# EAGLE design DATALOGGER_CA_ADC_V1 (EAGLE 9.5.1)

## Sheet 1 of 11
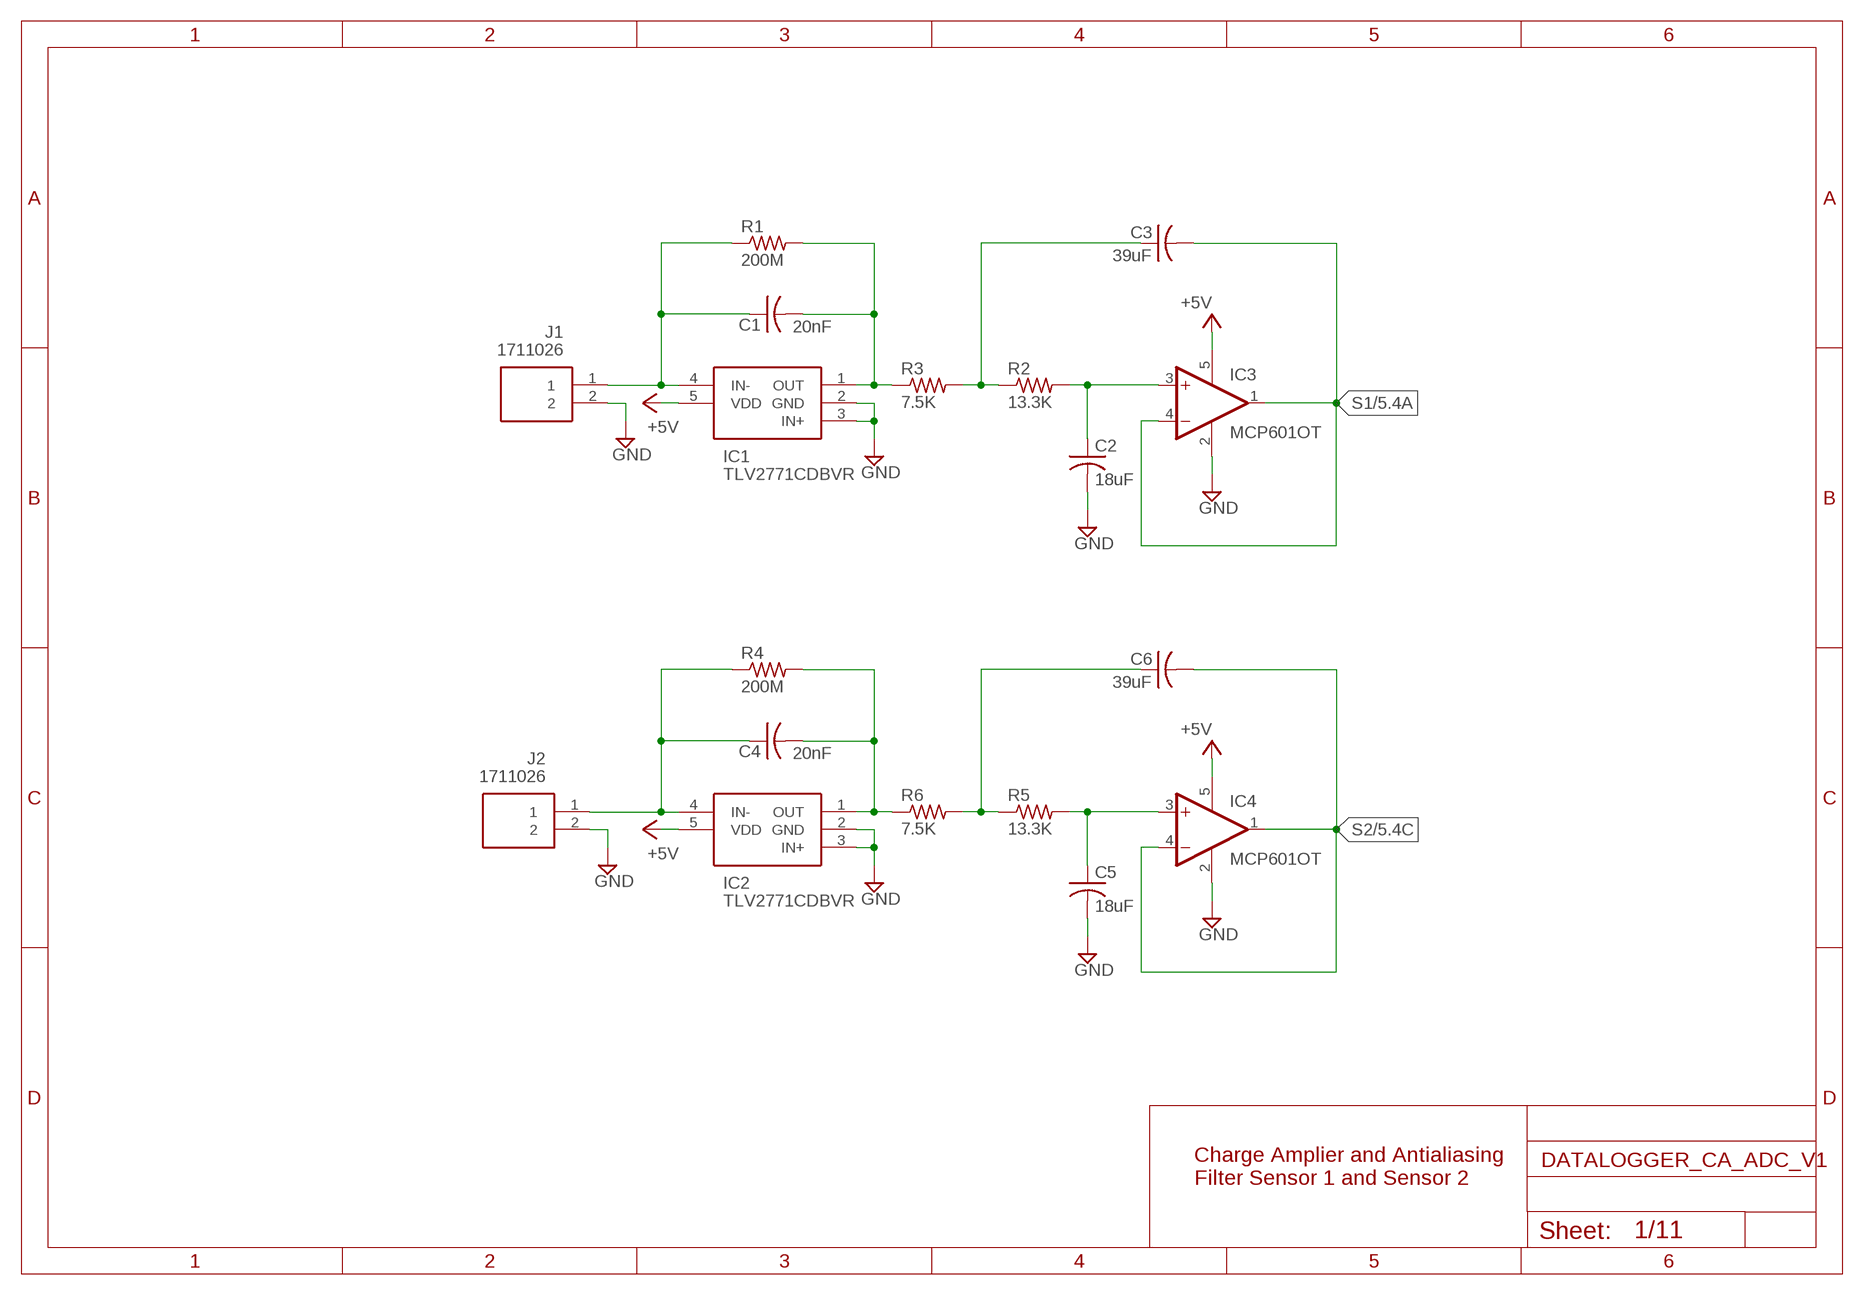
[diagram p0: schematic, sheet 1]

### Parts
C1  20nF  C-USC0805  [C0805]
C2  18uF  C-USC0805  [C0805]
C3  39uF  C-USC0805  [C0805]
C4  20nF  C-USC0805  [C0805]
C5  18uF  C-USC0805  [C0805]
C6  39uF  C-USC0805  [C0805]
IC1  TLV2771CDBVR  [SOT95P280X145-5N]
IC2  TLV2771CDBVR  [SOT95P280X145-5N]
IC3  MCP601OT  [SOT23-5]
IC4  MCP601OT  [SOT23-5]
J1  1711026  [SHDR2W110P0X500_1X2_1000X1120X]
J2  1711026  [SHDR2W110P0X500_1X2_1000X1120X]
R1  200M  R-US_R0805  [R0805]
R2  13.3K  R-US_R0805  [R0805]
R3  7.5K  R-US_R0805  [R0805]
R4  200M  R-US_R0805  [R0805]
R5  13.3K  R-US_R0805  [R0805]
R6  7.5K  R-US_R0805  [R0805]

### Nets
+5V: IC1.5(VDD) IC2.5(VDD) IC3.5(V+) IC4.5(V+) ; also sheet 2,3,4,9,10,11
GND: C2.2 C5.2 IC1.2(GND) IC1.3(IN+) IC2.2(GND) IC2.3(IN+) IC3.2(V-) IC4.2(V-) J1.2 J2.2 ; also sheet 2,3,4,5,6,7,8,9,10,11
N$1: C1.1 IC1.4(IN-) J1.1 R1.1
N$2: C1.2 IC1.1(OUT) R1.2 R3.1
N$3: C2.1 IC3.3(+IN) R2.2
N$4: C3.1 R2.1 R3.2
N$5: C4.1 IC2.4(IN-) J2.1 R4.1
N$6: C4.2 IC2.1(OUT) R4.2 R6.1
N$7: C5.1 IC4.3(+IN) R5.2
N$8: C6.1 R5.1 R6.2
S1: C3.2 IC3.1(OUT) IC3.4(-IN) ; also sheet 5
S2: C6.2 IC4.1(OUT) IC4.4(-IN) ; also sheet 5

### Notes on the sheet
- Charge Amplier and Antialiasing 
  Filter Sensor 1 and Sensor 2

## Sheet 2 of 11
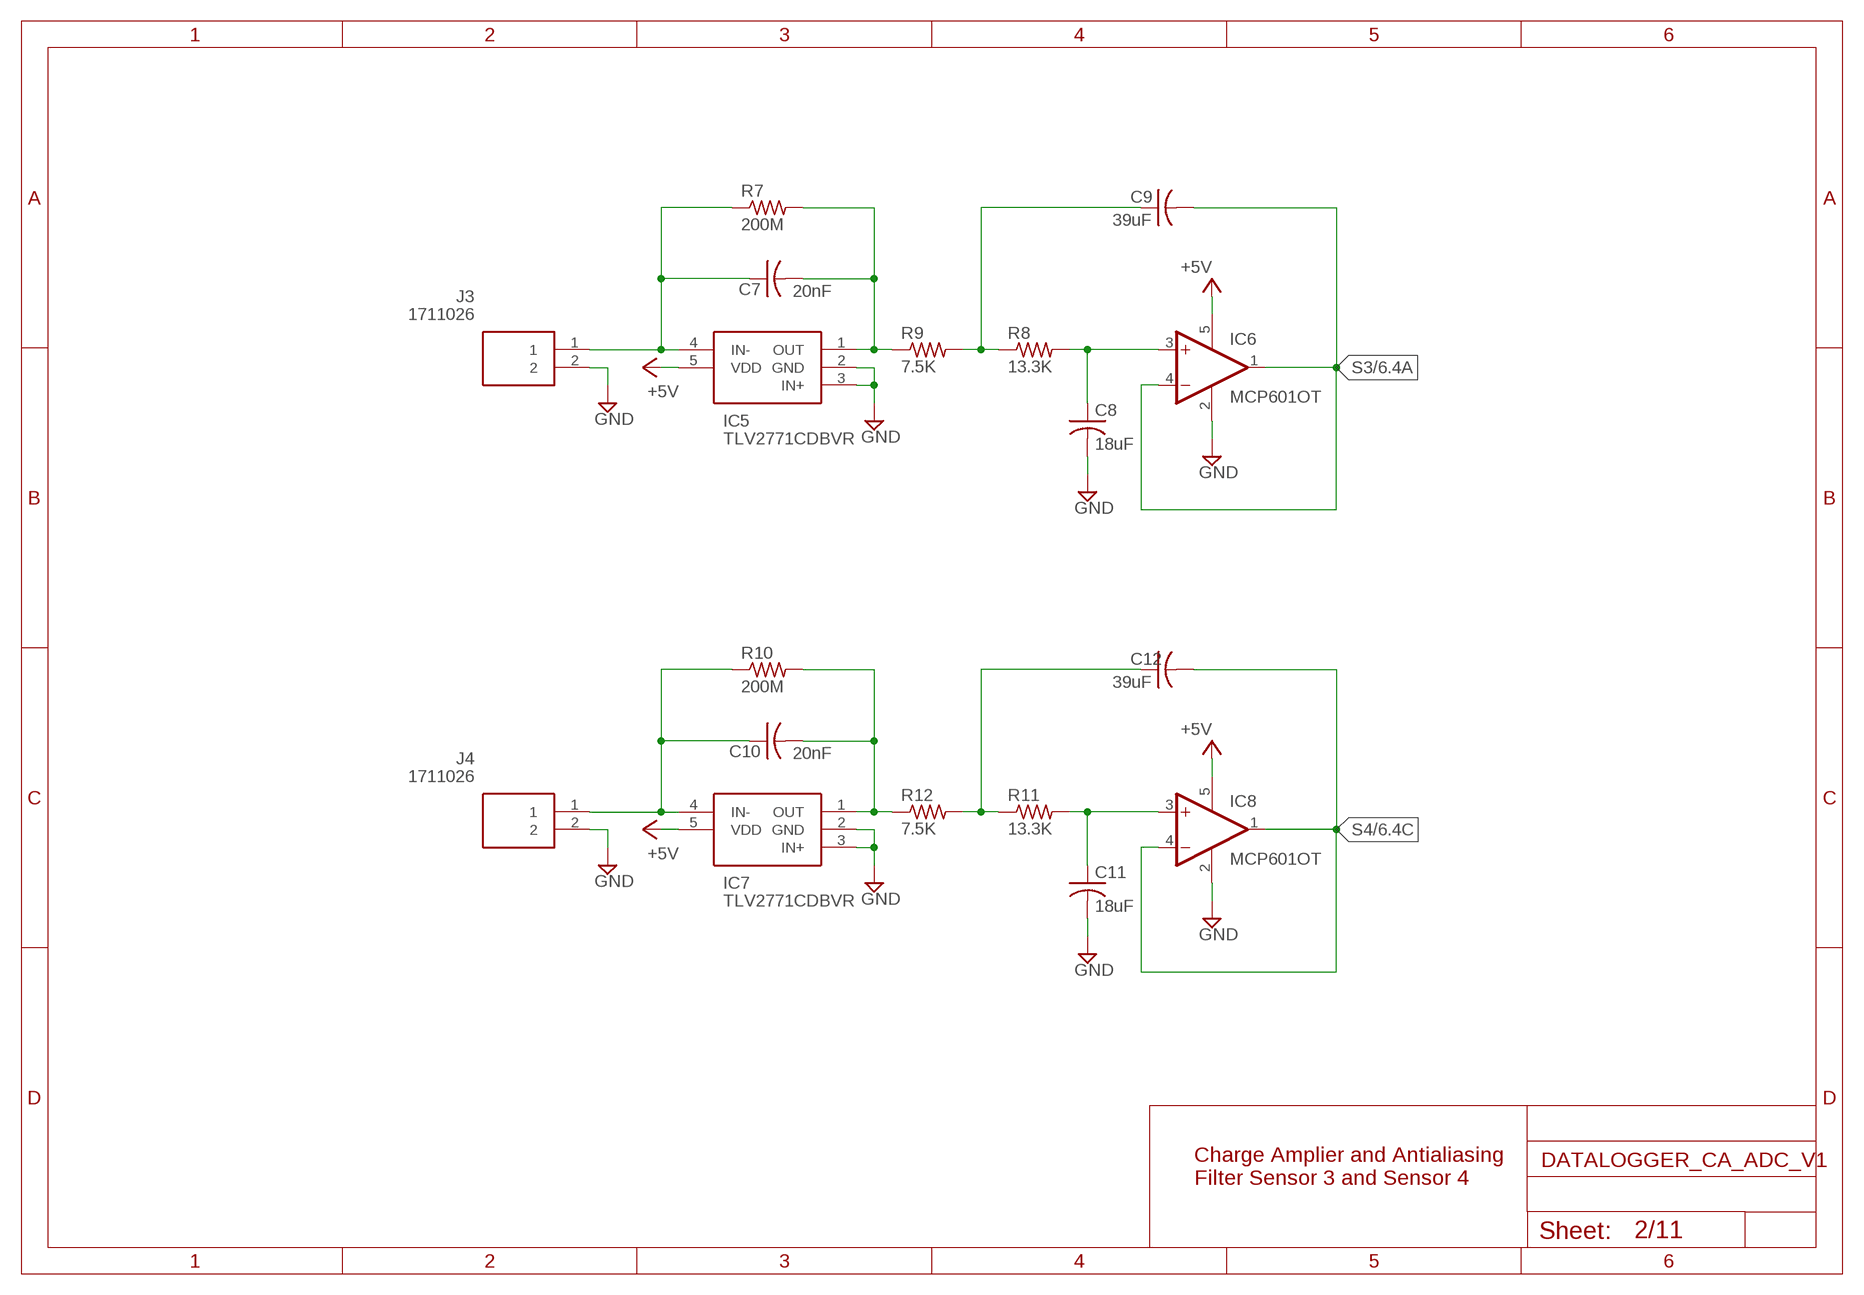
[diagram p1: schematic, sheet 2]

### Parts
C7  20nF  C-USC0805  [C0805]
C8  18uF  C-USC0805  [C0805]
C9  39uF  C-USC0805  [C0805]
C10  20nF  C-USC0805  [C0805]
C11  18uF  C-USC0805  [C0805]
C12  39uF  C-USC0805  [C0805]
IC5  TLV2771CDBVR  [SOT95P280X145-5N]
IC6  MCP601OT  [SOT23-5]
IC7  TLV2771CDBVR  [SOT95P280X145-5N]
IC8  MCP601OT  [SOT23-5]
J3  1711026  [SHDR2W110P0X500_1X2_1000X1120X]
J4  1711026  [SHDR2W110P0X500_1X2_1000X1120X]
R7  200M  R-US_R0805  [R0805]
R8  13.3K  R-US_R0805  [R0805]
R9  7.5K  R-US_R0805  [R0805]
R10  200M  R-US_R0805  [R0805]
R11  13.3K  R-US_R0805  [R0805]
R12  7.5K  R-US_R0805  [R0805]

### Nets
+5V: IC5.5(VDD) IC6.5(V+) IC7.5(VDD) IC8.5(V+) ; also sheet 1,3,4,9,10,11
GND: C8.2 C11.2 IC5.2(GND) IC5.3(IN+) IC6.2(V-) IC7.2(GND) IC7.3(IN+) IC8.2(V-) J3.2 J4.2 ; also sheet 1,3,4,5,6,7,8,9,10,11
N$9: C7.1 IC5.4(IN-) J3.1 R7.1
N$10: C7.2 IC5.1(OUT) R7.2 R9.1
N$11: C8.1 IC6.3(+IN) R8.2
N$12: C9.1 R8.1 R9.2
N$13: C10.1 IC7.4(IN-) J4.1 R10.1
N$14: C10.2 IC7.1(OUT) R10.2 R12.1
N$15: C11.1 IC8.3(+IN) R11.2
N$16: C12.1 R11.1 R12.2
S3: C9.2 IC6.1(OUT) IC6.4(-IN) ; also sheet 6
S4: C12.2 IC8.1(OUT) IC8.4(-IN) ; also sheet 6

### Notes on the sheet
- Charge Amplier and Antialiasing 
  Filter Sensor 3 and Sensor 4

## Sheet 3 of 11
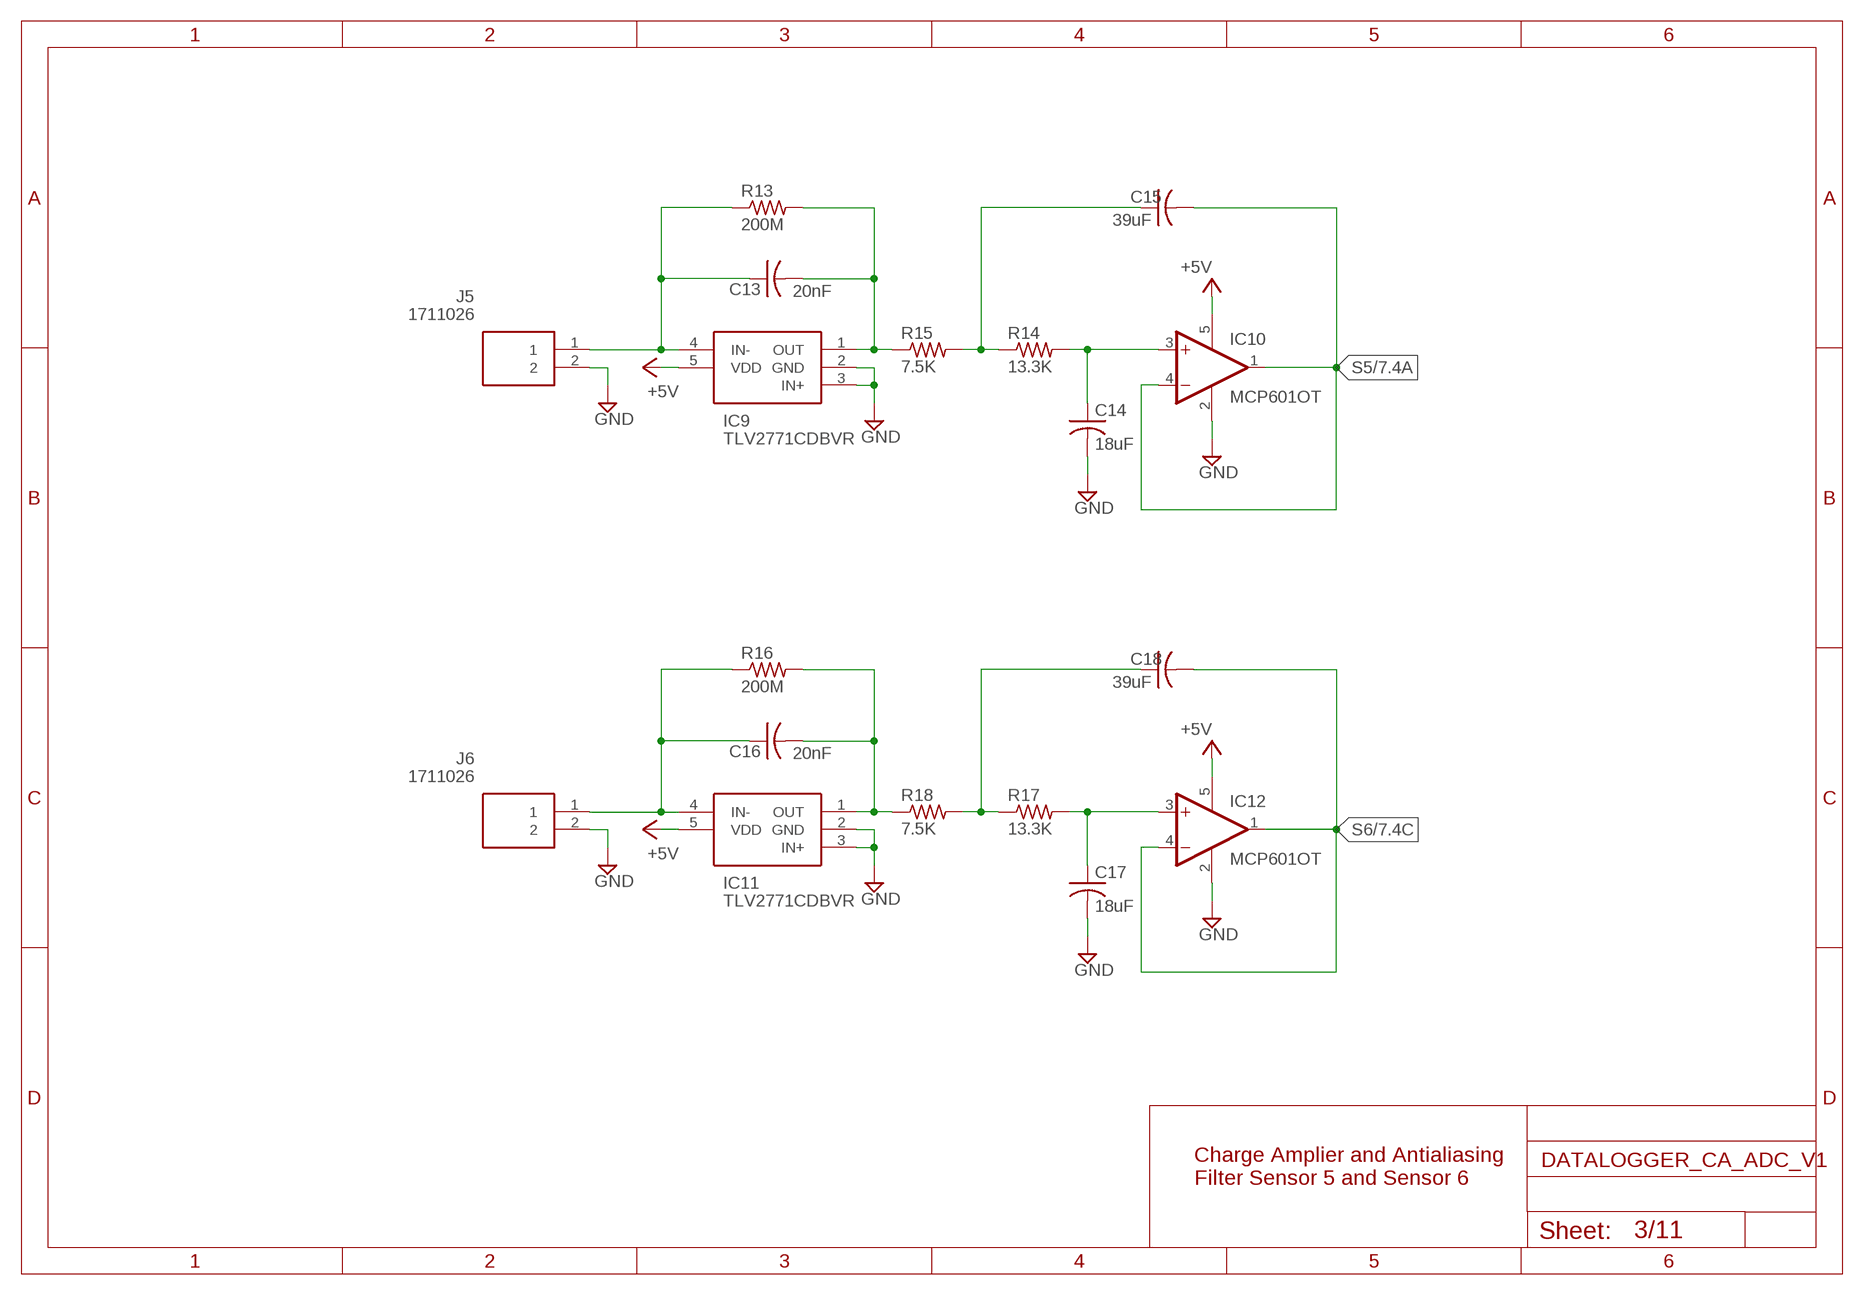
[diagram p2: schematic, sheet 3]

### Parts
C13  20nF  C-USC0805  [C0805]
C14  18uF  C-USC0805  [C0805]
C15  39uF  C-USC0805  [C0805]
C16  20nF  C-USC0805  [C0805]
C17  18uF  C-USC0805  [C0805]
C18  39uF  C-USC0805  [C0805]
IC9  TLV2771CDBVR  [SOT95P280X145-5N]
IC10  MCP601OT  [SOT23-5]
IC11  TLV2771CDBVR  [SOT95P280X145-5N]
IC12  MCP601OT  [SOT23-5]
J5  1711026  [SHDR2W110P0X500_1X2_1000X1120X]
J6  1711026  [SHDR2W110P0X500_1X2_1000X1120X]
R13  200M  R-US_R0805  [R0805]
R14  13.3K  R-US_R0805  [R0805]
R15  7.5K  R-US_R0805  [R0805]
R16  200M  R-US_R0805  [R0805]
R17  13.3K  R-US_R0805  [R0805]
R18  7.5K  R-US_R0805  [R0805]

### Nets
+5V: IC9.5(VDD) IC10.5(V+) IC11.5(VDD) IC12.5(V+) ; also sheet 1,2,4,9,10,11
GND: C14.2 C17.2 IC9.2(GND) IC9.3(IN+) IC10.2(V-) IC11.2(GND) IC11.3(IN+) IC12.2(V-) J5.2 J6.2 ; also sheet 1,2,4,5,6,7,8,9,10,11
N$17: C13.1 IC9.4(IN-) J5.1 R13.1
N$18: C13.2 IC9.1(OUT) R13.2 R15.1
N$19: C14.1 IC10.3(+IN) R14.2
N$20: C15.1 R14.1 R15.2
N$21: C16.1 IC11.4(IN-) J6.1 R16.1
N$22: C16.2 IC11.1(OUT) R16.2 R18.1
N$23: C17.1 IC12.3(+IN) R17.2
N$24: C18.1 R17.1 R18.2
S5: C15.2 IC10.1(OUT) IC10.4(-IN) ; also sheet 7
S6: C18.2 IC12.1(OUT) IC12.4(-IN) ; also sheet 7

### Notes on the sheet
- Charge Amplier and Antialiasing 
  Filter Sensor 5 and Sensor 6

## Sheet 4 of 11
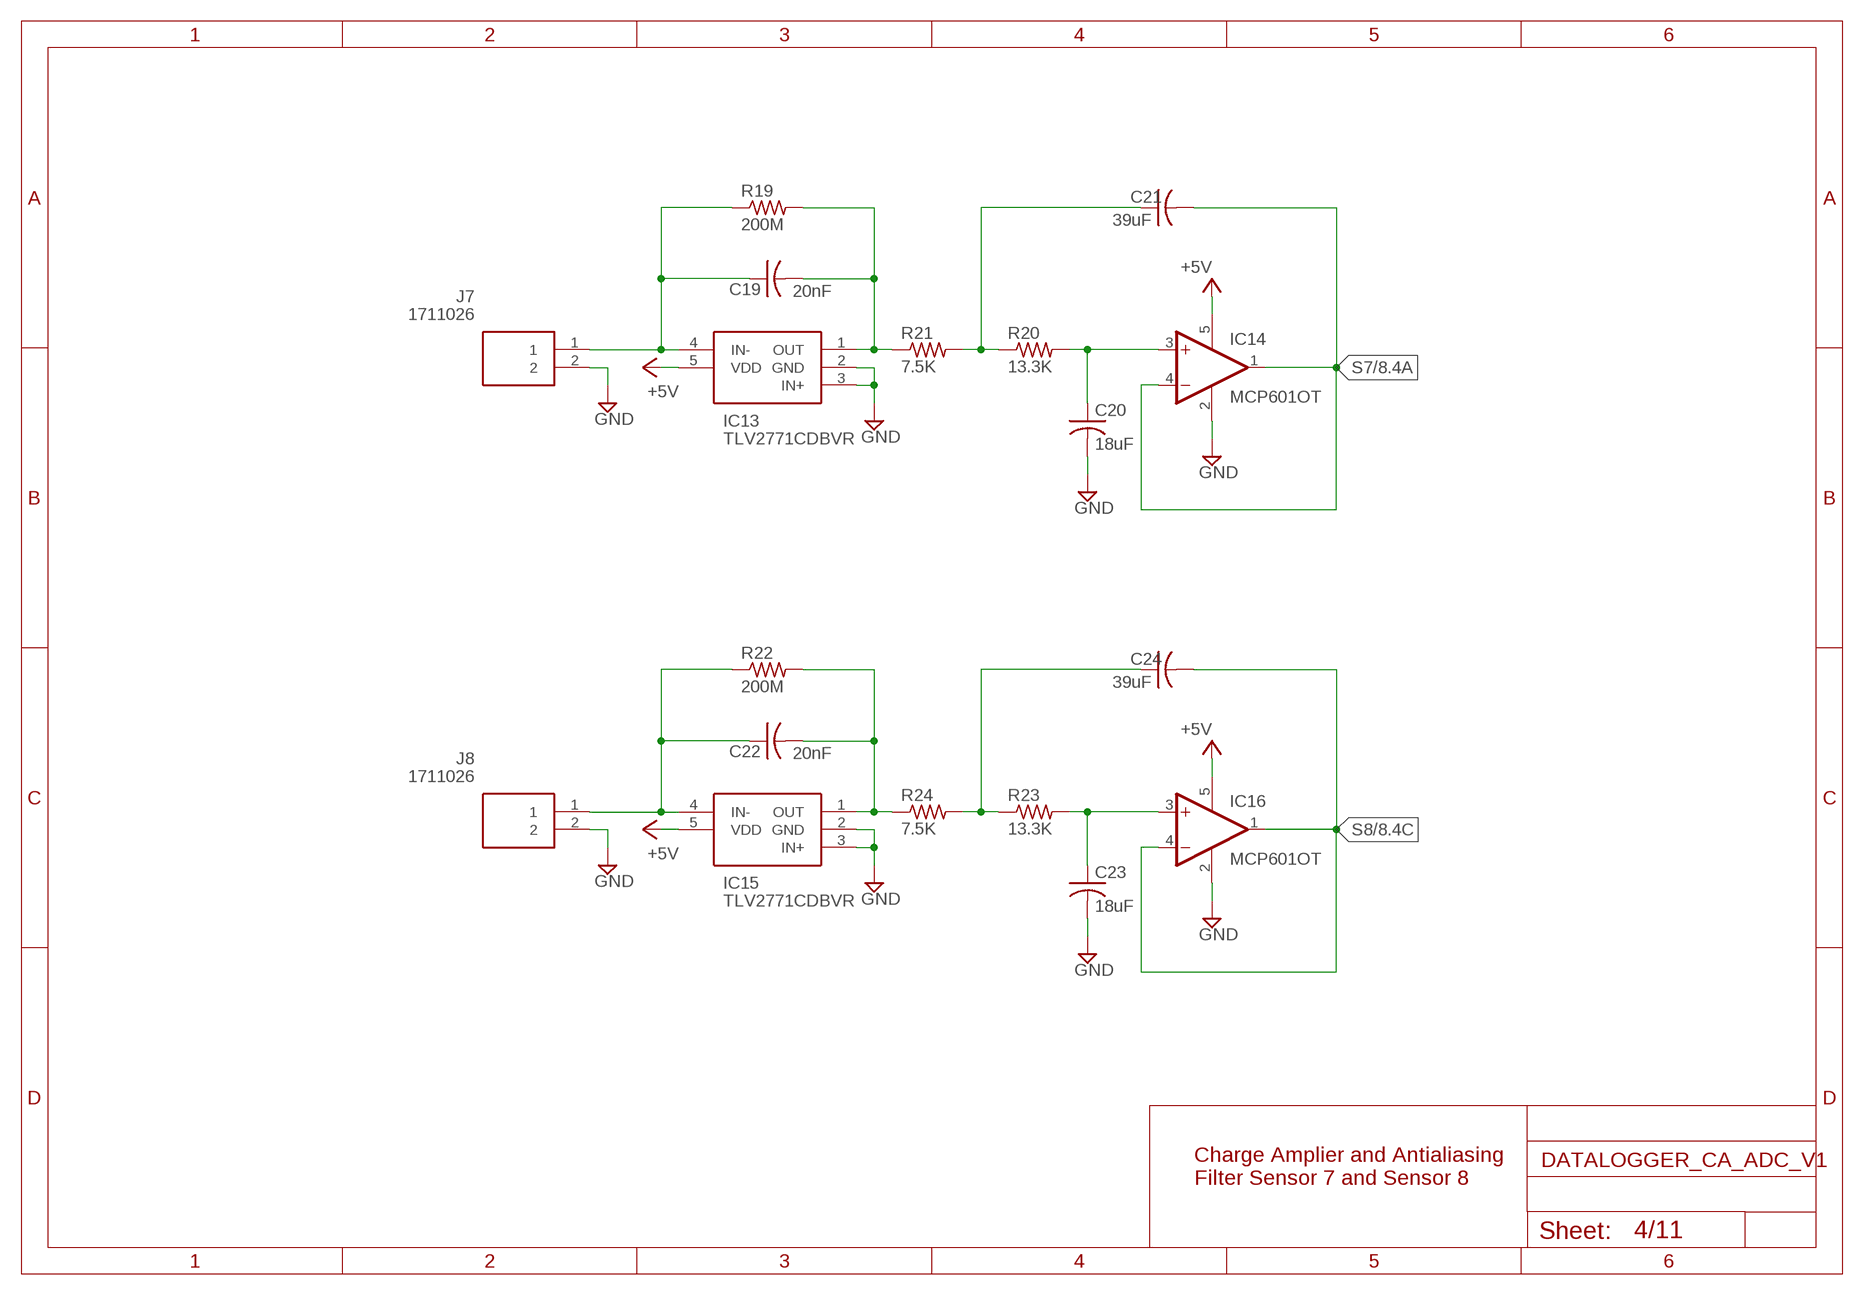
[diagram p3: schematic, sheet 4]

### Parts
C19  20nF  C-USC0805  [C0805]
C20  18uF  C-USC0805  [C0805]
C21  39uF  C-USC0805  [C0805]
C22  20nF  C-USC0805  [C0805]
C23  18uF  C-USC0805  [C0805]
C24  39uF  C-USC0805  [C0805]
IC13  TLV2771CDBVR  [SOT95P280X145-5N]
IC14  MCP601OT  [SOT23-5]
IC15  TLV2771CDBVR  [SOT95P280X145-5N]
IC16  MCP601OT  [SOT23-5]
J7  1711026  [SHDR2W110P0X500_1X2_1000X1120X]
J8  1711026  [SHDR2W110P0X500_1X2_1000X1120X]
R19  200M  R-US_R0805  [R0805]
R20  13.3K  R-US_R0805  [R0805]
R21  7.5K  R-US_R0805  [R0805]
R22  200M  R-US_R0805  [R0805]
R23  13.3K  R-US_R0805  [R0805]
R24  7.5K  R-US_R0805  [R0805]

### Nets
+5V: IC13.5(VDD) IC14.5(V+) IC15.5(VDD) IC16.5(V+) ; also sheet 1,2,3,9,10,11
GND: C20.2 C23.2 IC13.2(GND) IC13.3(IN+) IC14.2(V-) IC15.2(GND) IC15.3(IN+) IC16.2(V-) J7.2 J8.2 ; also sheet 1,2,3,5,6,7,8,9,10,11
N$25: C19.1 IC13.4(IN-) J7.1 R19.1
N$26: C19.2 IC13.1(OUT) R19.2 R21.1
N$27: C20.1 IC14.3(+IN) R20.2
N$28: C21.1 R20.1 R21.2
N$29: C22.1 IC15.4(IN-) J8.1 R22.1
N$30: C22.2 IC15.1(OUT) R22.2 R24.1
N$31: C23.1 IC16.3(+IN) R23.2
N$32: C24.1 R23.1 R24.2
S7: C21.2 IC14.1(OUT) IC14.4(-IN) ; also sheet 8
S8: C24.2 IC16.1(OUT) IC16.4(-IN) ; also sheet 8

### Notes on the sheet
- Charge Amplier and Antialiasing 
  Filter Sensor 7 and Sensor 8

## Sheet 5 of 11
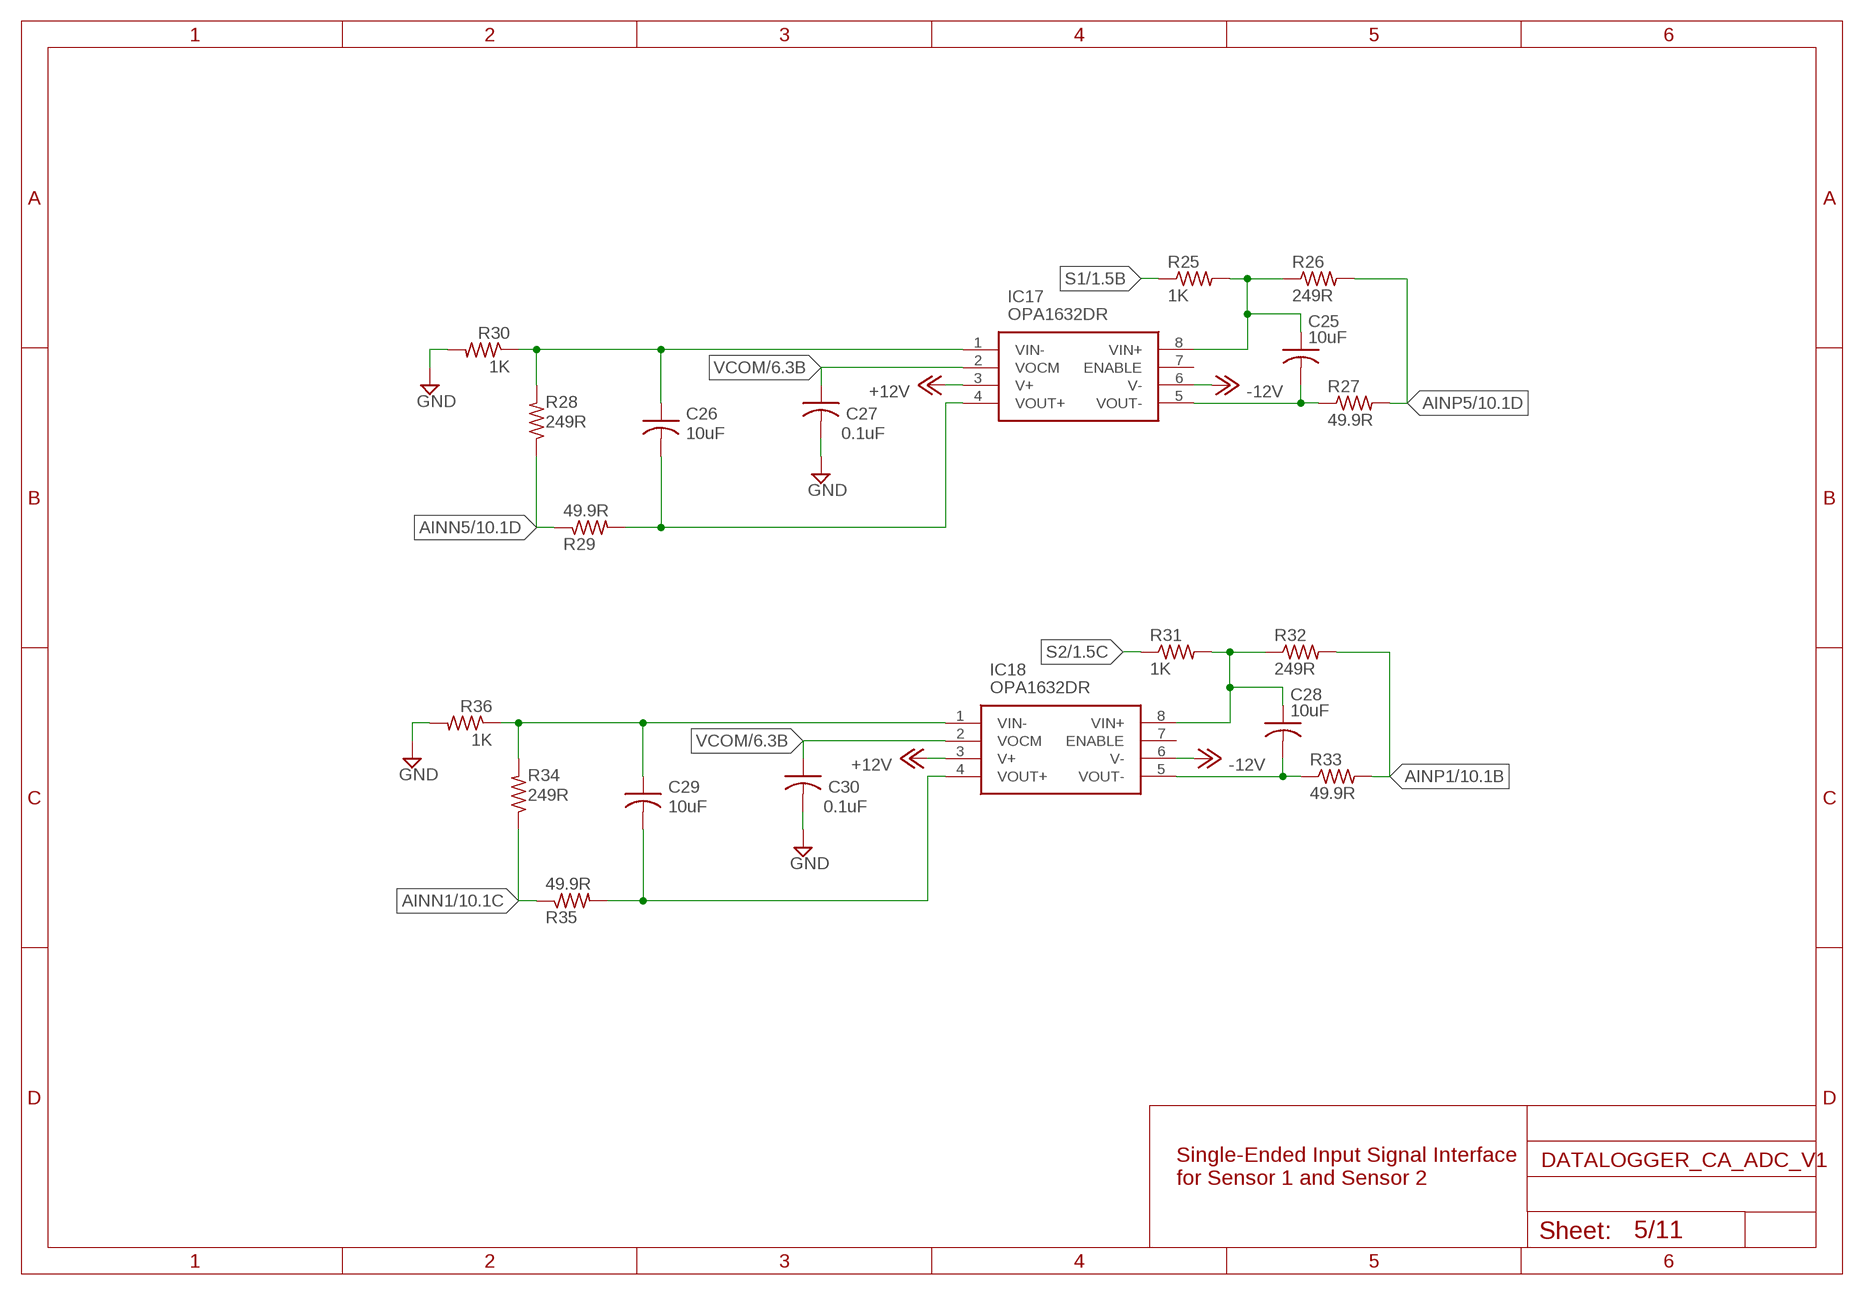
[diagram p4: schematic, sheet 5]

### Parts
C25  10uF  C-USC0805  [C0805]
C26  10uF  C-USC0805  [C0805]
C27  0.1uF  C-USC0805  [C0805]
C28  10uF  C-USC0805  [C0805]
C29  10uF  C-USC0805  [C0805]
C30  0.1uF  C-USC0805  [C0805]
IC17  OPA1632DR  [SOIC127P600X175-8N]
IC18  OPA1632DR  [SOIC127P600X175-8N]
R25  1K  R-US_R0805  [R0805]
R26  249R  R-US_R0805  [R0805]
R27  49.9R  R-US_R0805  [R0805]
R28  249R  R-US_R0805  [R0805]
R29  49.9R  R-US_R0805  [R0805]
R30  1K  R-US_R0805  [R0805]
R31  1K  R-US_R0805  [R0805]
R32  249R  R-US_R0805  [R0805]
R33  49.9R  R-US_R0805  [R0805]
R34  249R  R-US_R0805  [R0805]
R35  49.9R  R-US_R0805  [R0805]
R36  1K  R-US_R0805  [R0805]

### Nets
+12V: IC17.3(V+) IC18.3(V+) ; also sheet 6,7,8,9
-12V: IC17.6(V-) IC18.6(V-) ; also sheet 6,7,8,9
AINN1: R34.1 R35.1 ; also sheet 10,11
AINN5: R28.1 R29.1 ; also sheet 10,11
AINP1: R32.2 R33.2 ; also sheet 10,11
AINP5: R26.2 R27.2 ; also sheet 10,11
GND: C27.2 C30.2 R30.2 R36.2 ; also sheet 1,2,3,4,6,7,8,9,10,11
N$33: C25.1 IC17.8(VIN+) R25.2 R26.1
N$34: C25.2 IC17.5(VOUT-) R27.1
N$35: C26.1 IC17.1(VIN-) R28.2 R30.1
N$36: C28.1 IC18.8(VIN+) R31.2 R32.1
N$37: C26.2 IC17.4(VOUT+) R29.2
N$38: C28.2 IC18.5(VOUT-) R33.1
N$39: C29.1 IC18.1(VIN-) R34.2 R36.1
N$40: C29.2 IC18.4(VOUT+) R35.2
S1: R25.1 ; also sheet 1
S2: R31.1 ; also sheet 1
VCOM: C27.1 C30.1 IC17.2(VOCM) IC18.2(VOCM) ; also sheet 6,7,8,10
Unconnected: IC17.7(ENABLE) IC18.7(ENABLE)

### Notes on the sheet
- Single-Ended Input Signal Interface 
  for Sensor 1 and Sensor 2

## Sheet 6 of 11
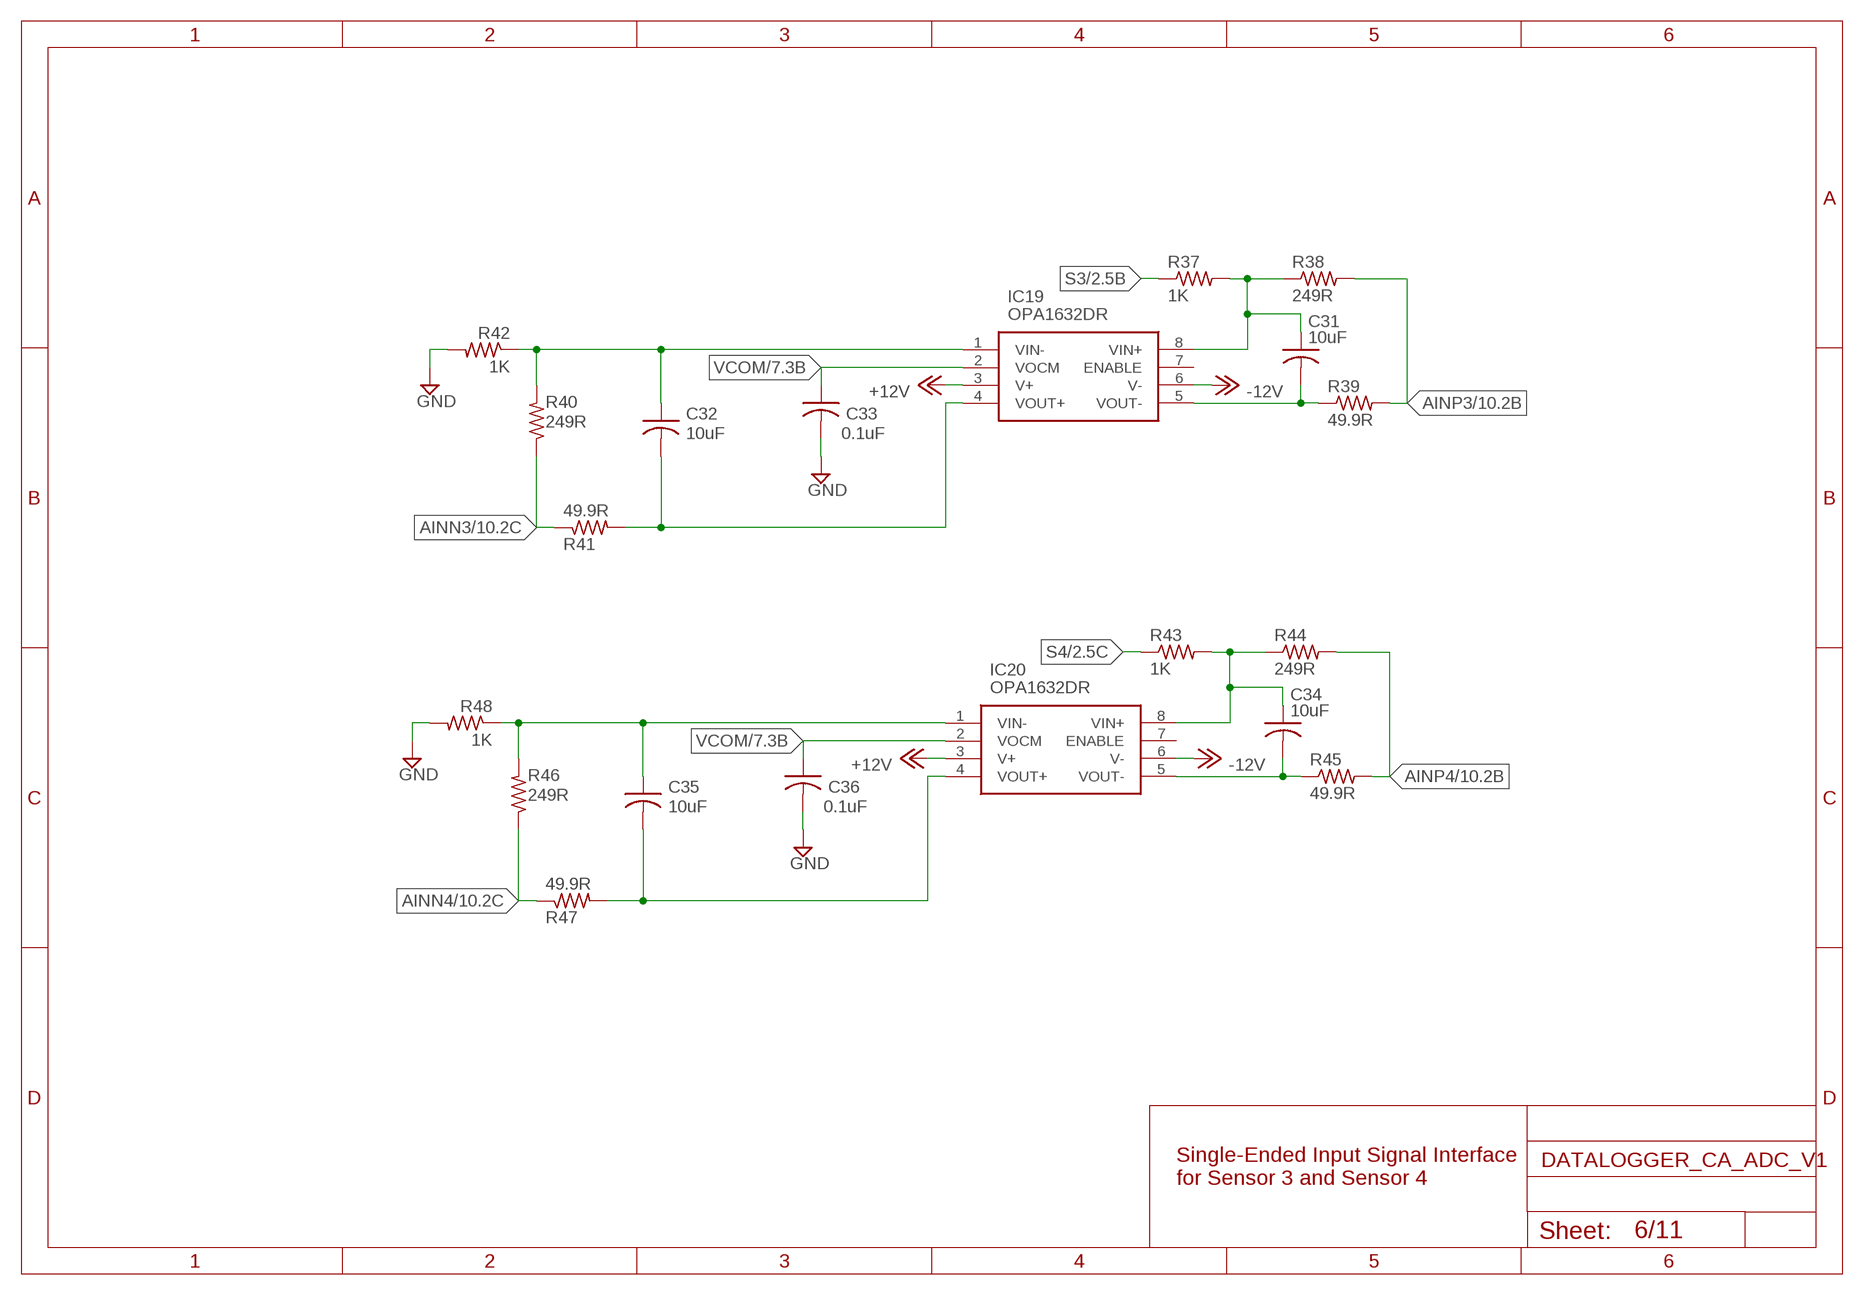
[diagram p5: schematic, sheet 6]

### Parts
C31  10uF  C-USC0805  [C0805]
C32  10uF  C-USC0805  [C0805]
C33  0.1uF  C-USC0805  [C0805]
C34  10uF  C-USC0805  [C0805]
C35  10uF  C-USC0805  [C0805]
C36  0.1uF  C-USC0805  [C0805]
IC19  OPA1632DR  [SOIC127P600X175-8N]
IC20  OPA1632DR  [SOIC127P600X175-8N]
R37  1K  R-US_R0805  [R0805]
R38  249R  R-US_R0805  [R0805]
R39  49.9R  R-US_R0805  [R0805]
R40  249R  R-US_R0805  [R0805]
R41  49.9R  R-US_R0805  [R0805]
R42  1K  R-US_R0805  [R0805]
R43  1K  R-US_R0805  [R0805]
R44  249R  R-US_R0805  [R0805]
R45  49.9R  R-US_R0805  [R0805]
R46  249R  R-US_R0805  [R0805]
R47  49.9R  R-US_R0805  [R0805]
R48  1K  R-US_R0805  [R0805]

### Nets
+12V: IC19.3(V+) IC20.3(V+) ; also sheet 5,7,8,9
-12V: IC19.6(V-) IC20.6(V-) ; also sheet 5,7,8,9
AINN3: R40.1 R41.1 ; also sheet 10,11
AINN4: R46.1 R47.1 ; also sheet 10,11
AINP3: R38.2 R39.2 ; also sheet 10,11
AINP4: R44.2 R45.2 ; also sheet 10,11
GND: C33.2 C36.2 R42.2 R48.2 ; also sheet 1,2,3,4,5,7,8,9,10,11
N$41: C31.1 IC19.8(VIN+) R37.2 R38.1
N$42: C31.2 IC19.5(VOUT-) R39.1
N$43: C32.1 IC19.1(VIN-) R40.2 R42.1
N$44: C32.2 IC19.4(VOUT+) R41.2
N$45: C34.1 IC20.8(VIN+) R43.2 R44.1
N$46: C34.2 IC20.5(VOUT-) R45.1
N$47: C35.1 IC20.1(VIN-) R46.2 R48.1
N$48: C35.2 IC20.4(VOUT+) R47.2
S3: R37.1 ; also sheet 2
S4: R43.1 ; also sheet 2
VCOM: C33.1 C36.1 IC19.2(VOCM) IC20.2(VOCM) ; also sheet 5,7,8,10
Unconnected: IC19.7(ENABLE) IC20.7(ENABLE)

### Notes on the sheet
- Single-Ended Input Signal Interface 
  for Sensor 3 and Sensor 4

## Sheet 7 of 11
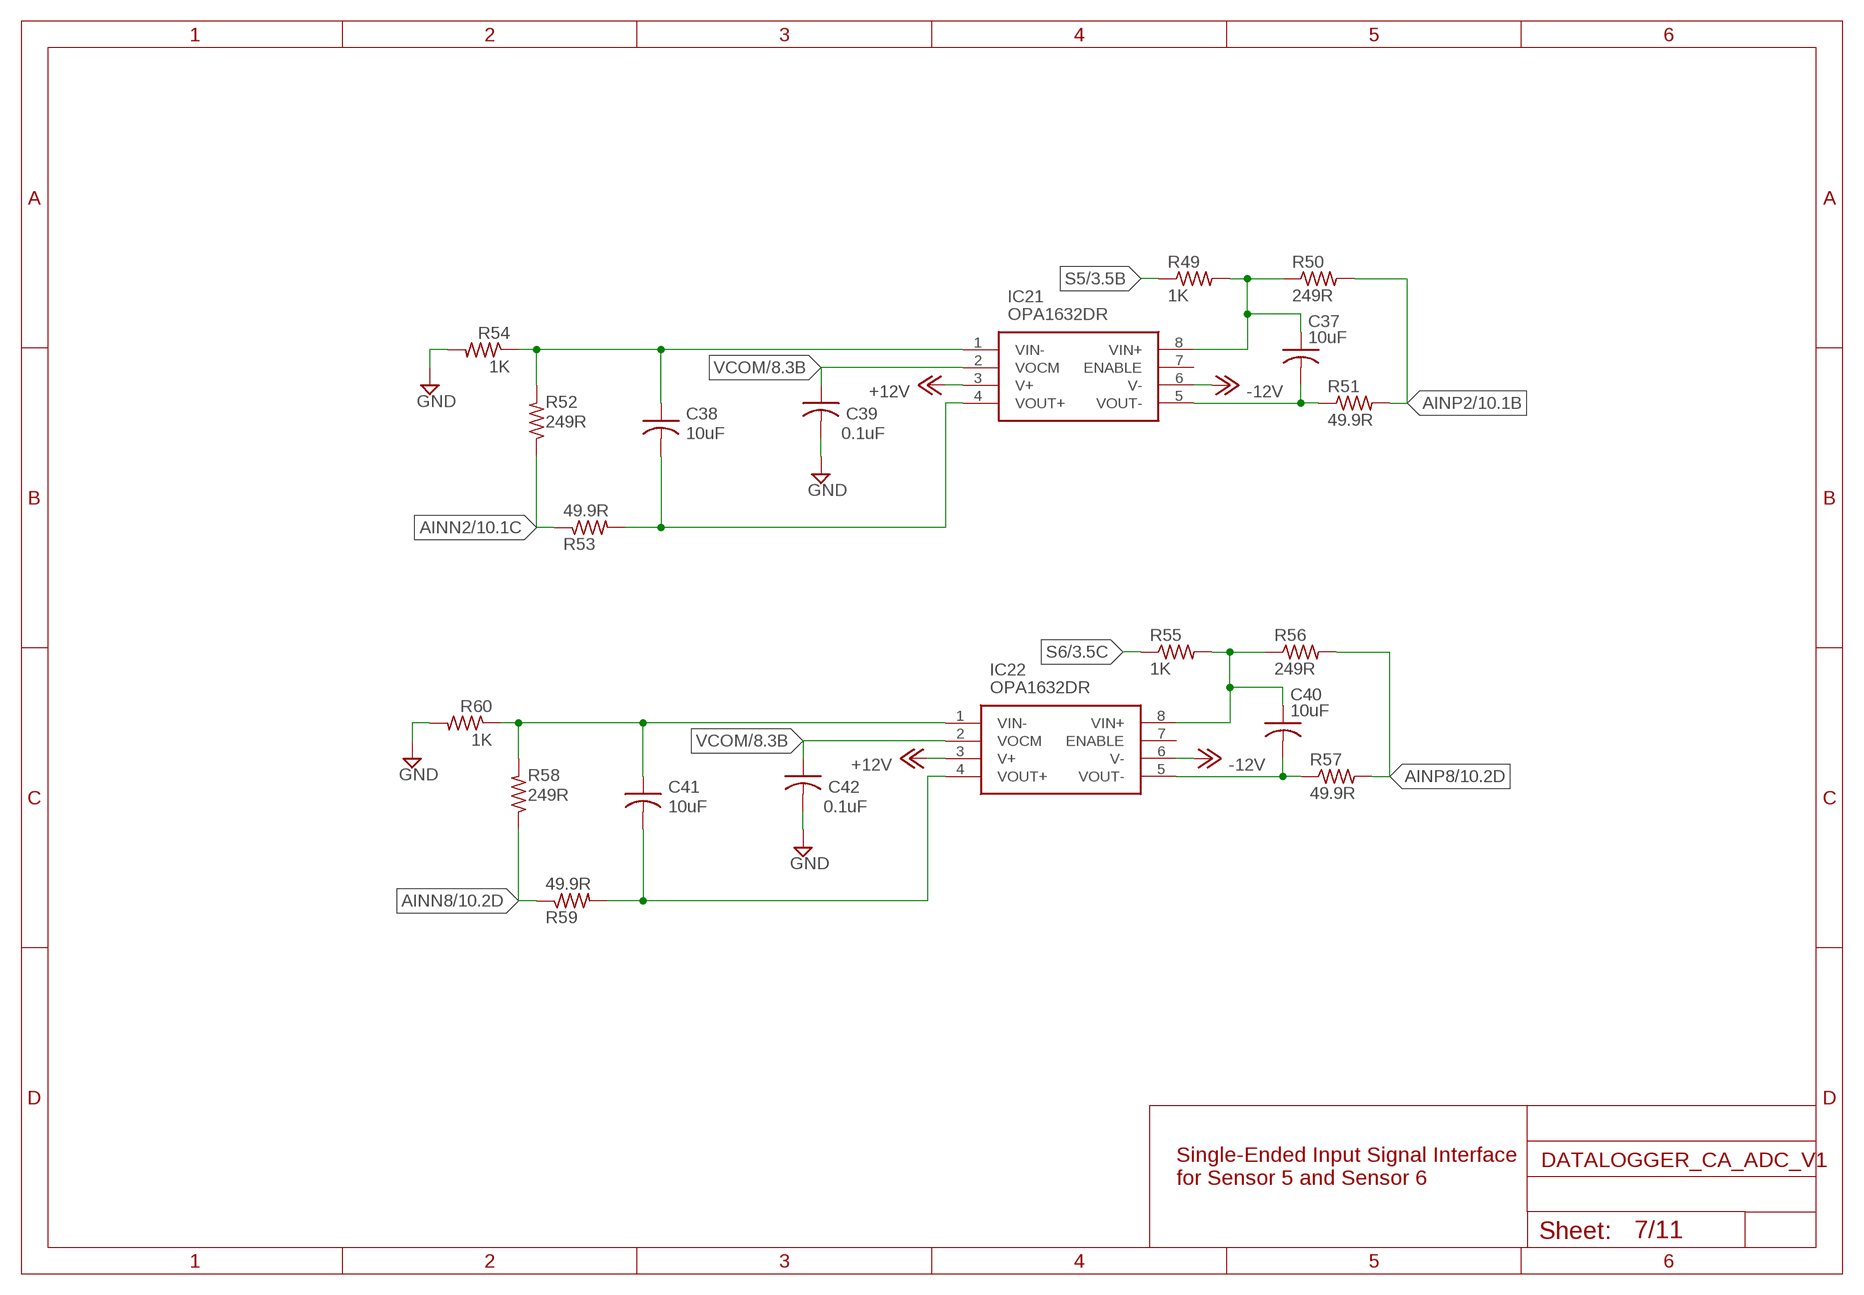
[diagram p6: schematic, sheet 7]

### Parts
C37  10uF  C-USC0805  [C0805]
C38  10uF  C-USC0805  [C0805]
C39  0.1uF  C-USC0805  [C0805]
C40  10uF  C-USC0805  [C0805]
C41  10uF  C-USC0805  [C0805]
C42  0.1uF  C-USC0805  [C0805]
IC21  OPA1632DR  [SOIC127P600X175-8N]
IC22  OPA1632DR  [SOIC127P600X175-8N]
R49  1K  R-US_R0805  [R0805]
R50  249R  R-US_R0805  [R0805]
R51  49.9R  R-US_R0805  [R0805]
R52  249R  R-US_R0805  [R0805]
R53  49.9R  R-US_R0805  [R0805]
R54  1K  R-US_R0805  [R0805]
R55  1K  R-US_R0805  [R0805]
R56  249R  R-US_R0805  [R0805]
R57  49.9R  R-US_R0805  [R0805]
R58  249R  R-US_R0805  [R0805]
R59  49.9R  R-US_R0805  [R0805]
R60  1K  R-US_R0805  [R0805]

### Nets
+12V: IC21.3(V+) IC22.3(V+) ; also sheet 5,6,8,9
-12V: IC21.6(V-) IC22.6(V-) ; also sheet 5,6,8,9
AINN2: R52.1 R53.1 ; also sheet 10,11
AINN8: R58.1 R59.1 ; also sheet 10,11
AINP2: R50.2 R51.2 ; also sheet 10,11
AINP8: R56.2 R57.2 ; also sheet 10,11
GND: C39.2 C42.2 R54.2 R60.2 ; also sheet 1,2,3,4,5,6,8,9,10,11
N$49: C37.1 IC21.8(VIN+) R49.2 R50.1
N$50: C37.2 IC21.5(VOUT-) R51.1
N$51: C38.1 IC21.1(VIN-) R52.2 R54.1
N$52: C38.2 IC21.4(VOUT+) R53.2
N$53: C40.1 IC22.8(VIN+) R55.2 R56.1
N$54: C40.2 IC22.5(VOUT-) R57.1
N$55: C41.1 IC22.1(VIN-) R58.2 R60.1
N$56: C41.2 IC22.4(VOUT+) R59.2
S5: R49.1 ; also sheet 3
S6: R55.1 ; also sheet 3
VCOM: C39.1 C42.1 IC21.2(VOCM) IC22.2(VOCM) ; also sheet 5,6,8,10
Unconnected: IC21.7(ENABLE) IC22.7(ENABLE)

### Notes on the sheet
- Single-Ended Input Signal Interface 
  for Sensor 5 and Sensor 6

## Sheet 8 of 11
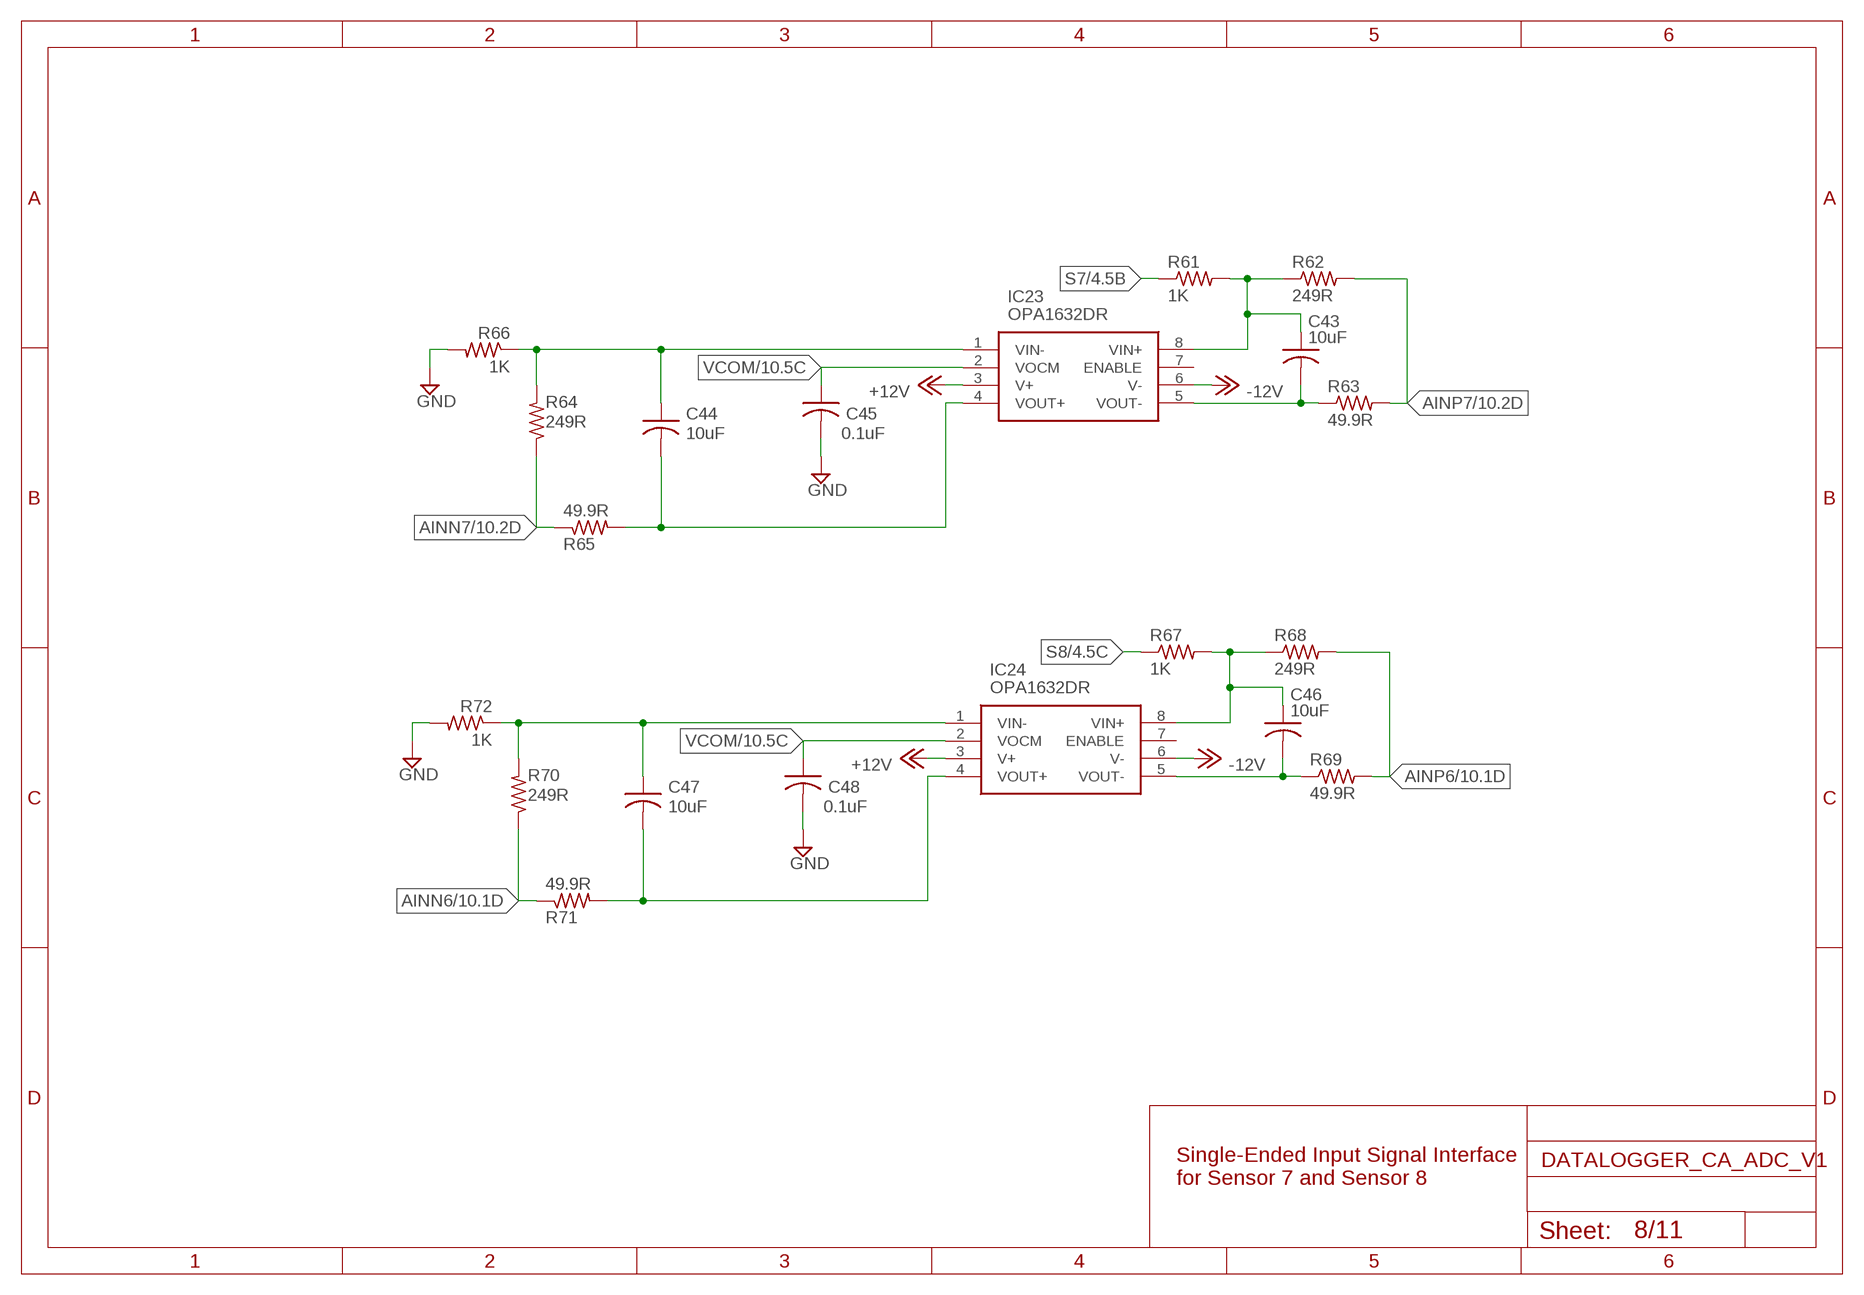
[diagram p7: schematic, sheet 8]

### Parts
C43  10uF  C-USC0805  [C0805]
C44  10uF  C-USC0805  [C0805]
C45  0.1uF  C-USC0805  [C0805]
C46  10uF  C-USC0805  [C0805]
C47  10uF  C-USC0805  [C0805]
C48  0.1uF  C-USC0805  [C0805]
IC23  OPA1632DR  [SOIC127P600X175-8N]
IC24  OPA1632DR  [SOIC127P600X175-8N]
R61  1K  R-US_R0805  [R0805]
R62  249R  R-US_R0805  [R0805]
R63  49.9R  R-US_R0805  [R0805]
R64  249R  R-US_R0805  [R0805]
R65  49.9R  R-US_R0805  [R0805]
R66  1K  R-US_R0805  [R0805]
R67  1K  R-US_R0805  [R0805]
R68  249R  R-US_R0805  [R0805]
R69  49.9R  R-US_R0805  [R0805]
R70  249R  R-US_R0805  [R0805]
R71  49.9R  R-US_R0805  [R0805]
R72  1K  R-US_R0805  [R0805]

### Nets
+12V: IC23.3(V+) IC24.3(V+) ; also sheet 5,6,7,9
-12V: IC23.6(V-) IC24.6(V-) ; also sheet 5,6,7,9
AINN6: R70.1 R71.1 ; also sheet 10,11
AINN7: R64.1 R65.1 ; also sheet 10,11
AINP6: R68.2 R69.2 ; also sheet 10,11
AINP7: R62.2 R63.2 ; also sheet 10,11
GND: C45.2 C48.2 R66.2 R72.2 ; also sheet 1,2,3,4,5,6,7,9,10,11
N$57: C43.1 IC23.8(VIN+) R61.2 R62.1
N$58: C43.2 IC23.5(VOUT-) R63.1
N$59: C44.1 IC23.1(VIN-) R64.2 R66.1
N$60: C44.2 IC23.4(VOUT+) R65.2
N$61: C46.1 IC24.8(VIN+) R67.2 R68.1
N$62: C46.2 IC24.5(VOUT-) R69.1
N$63: C47.1 IC24.1(VIN-) R70.2 R72.1
N$64: C47.2 IC24.4(VOUT+) R71.2
S7: R61.1 ; also sheet 4
S8: R67.1 ; also sheet 4
VCOM: C45.1 C48.1 IC23.2(VOCM) IC24.2(VOCM) ; also sheet 5,6,7,10
Unconnected: IC23.7(ENABLE) IC24.7(ENABLE)

### Notes on the sheet
- Single-Ended Input Signal Interface 
  for Sensor 7 and Sensor 8

## Sheet 9 of 11
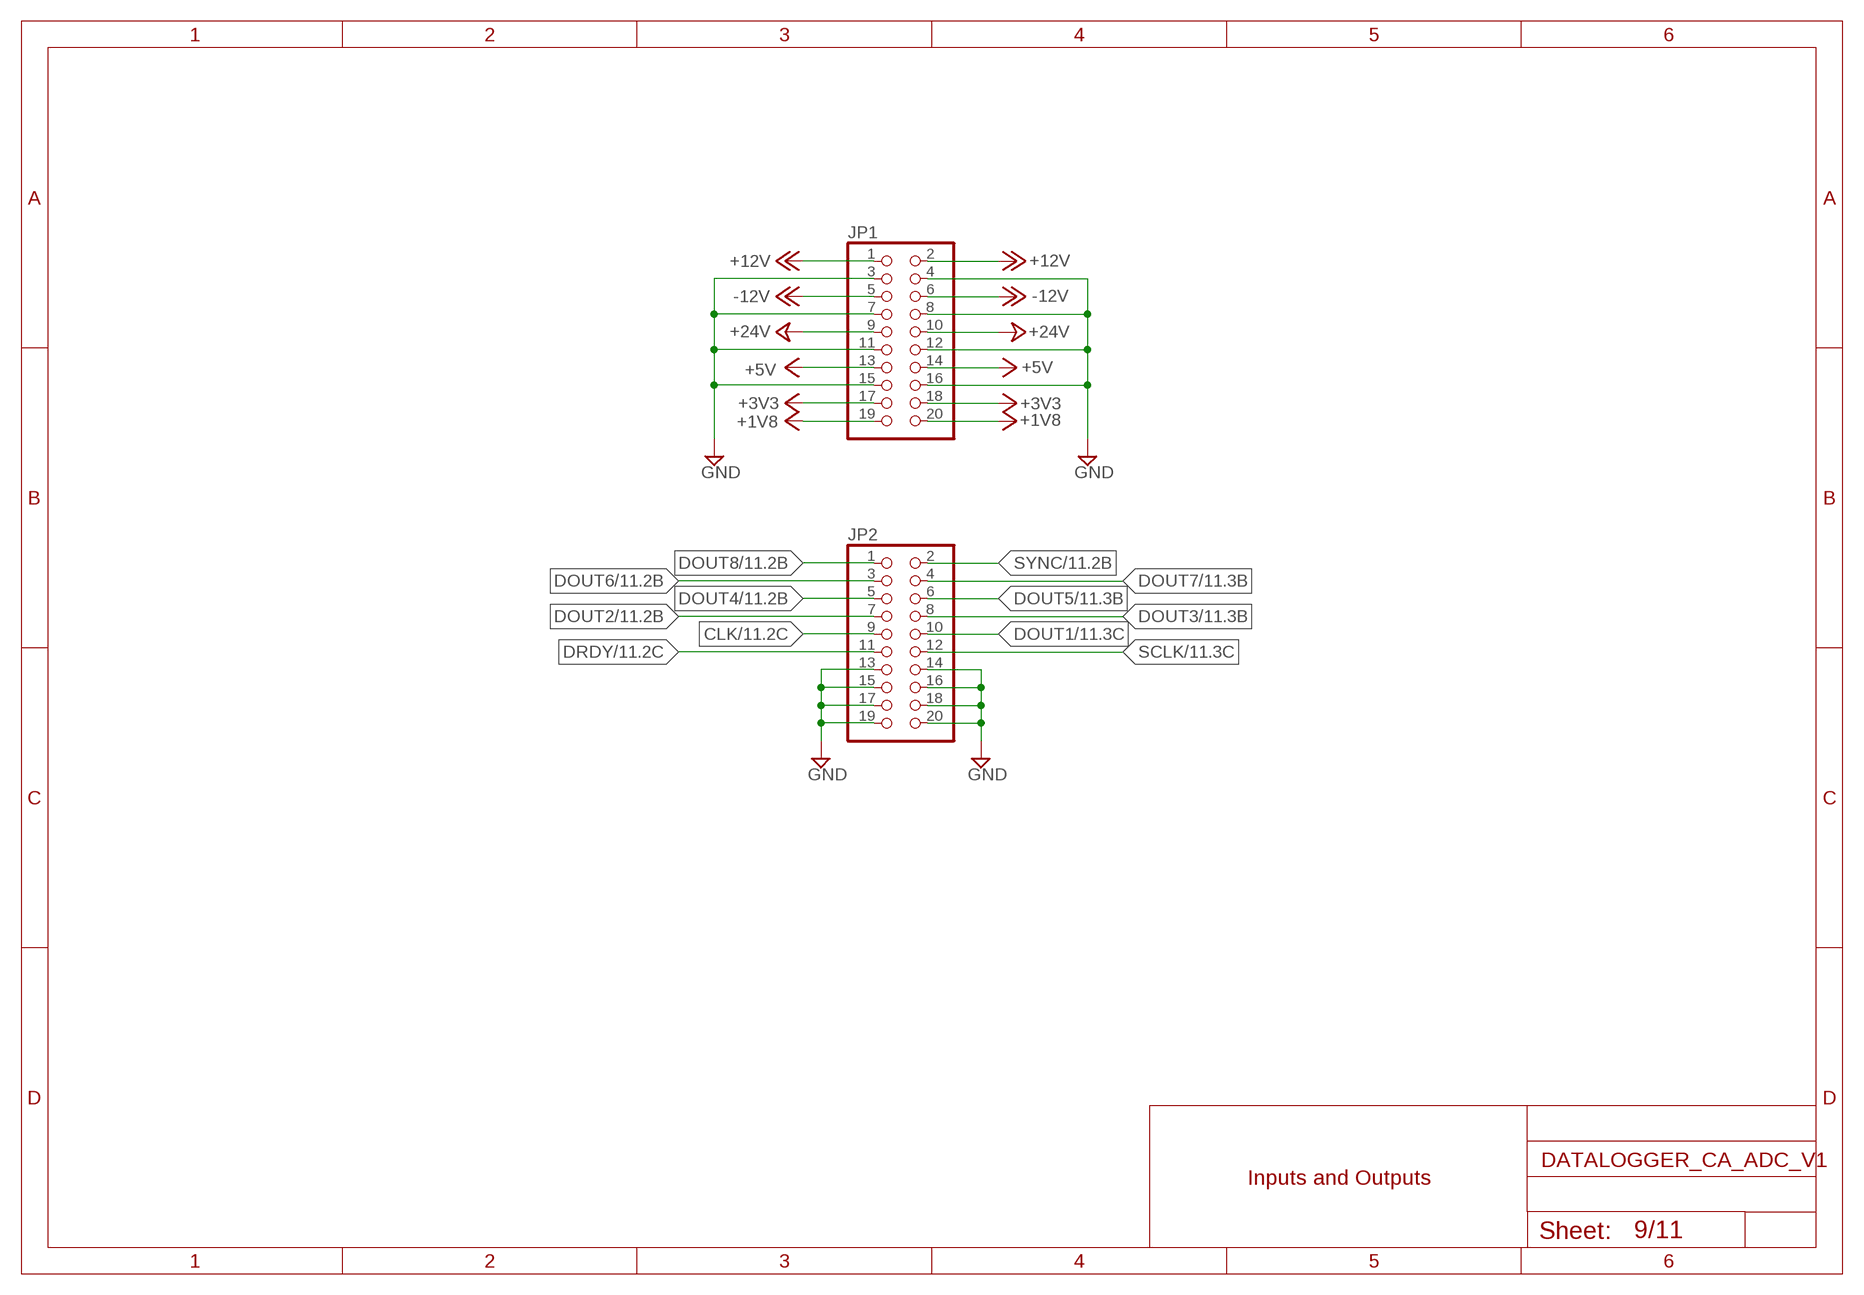
[diagram p8: schematic, sheet 9]

### Parts
JP1  PINHD-2X10  [2X10]
JP2  PINHD-2X10  [2X10]

### Nets
+1V8: JP1.19 JP1.20 ; also sheet 11
+3V3: JP1.17 JP1.18 ; also sheet 11
+5V: JP1.13 JP1.14 ; also sheet 1,2,3,4,10,11
+12V: JP1.1 JP1.2 ; also sheet 5,6,7,8
+24V: JP1.9 JP1.10
-12V: JP1.5 JP1.6 ; also sheet 5,6,7,8
CLK: JP2.9 ; also sheet 11
DOUT1: JP2.10 ; also sheet 11
DOUT2: JP2.7 ; also sheet 11
DOUT3: JP2.8 ; also sheet 11
DOUT4: JP2.5 ; also sheet 11
DOUT5: JP2.6 ; also sheet 11
DOUT6: JP2.3 ; also sheet 11
DOUT7: JP2.4 ; also sheet 11
DOUT8: JP2.1 ; also sheet 11
DRDY: JP2.11 ; also sheet 11
GND: JP1.3 JP1.4 JP1.7 JP1.8 JP1.11 JP1.12 JP1.15 JP1.16 JP2.13 JP2.14 JP2.15 JP2.16 JP2.17 JP2.18 JP2.19 JP2.20 ; also sheet 1,2,3,4,5,6,7,8,10,11
SCLK: JP2.12 ; also sheet 11
SYNC: JP2.2 ; also sheet 11

### Notes on the sheet
- Inputs and Outputs

## Sheet 10 of 11
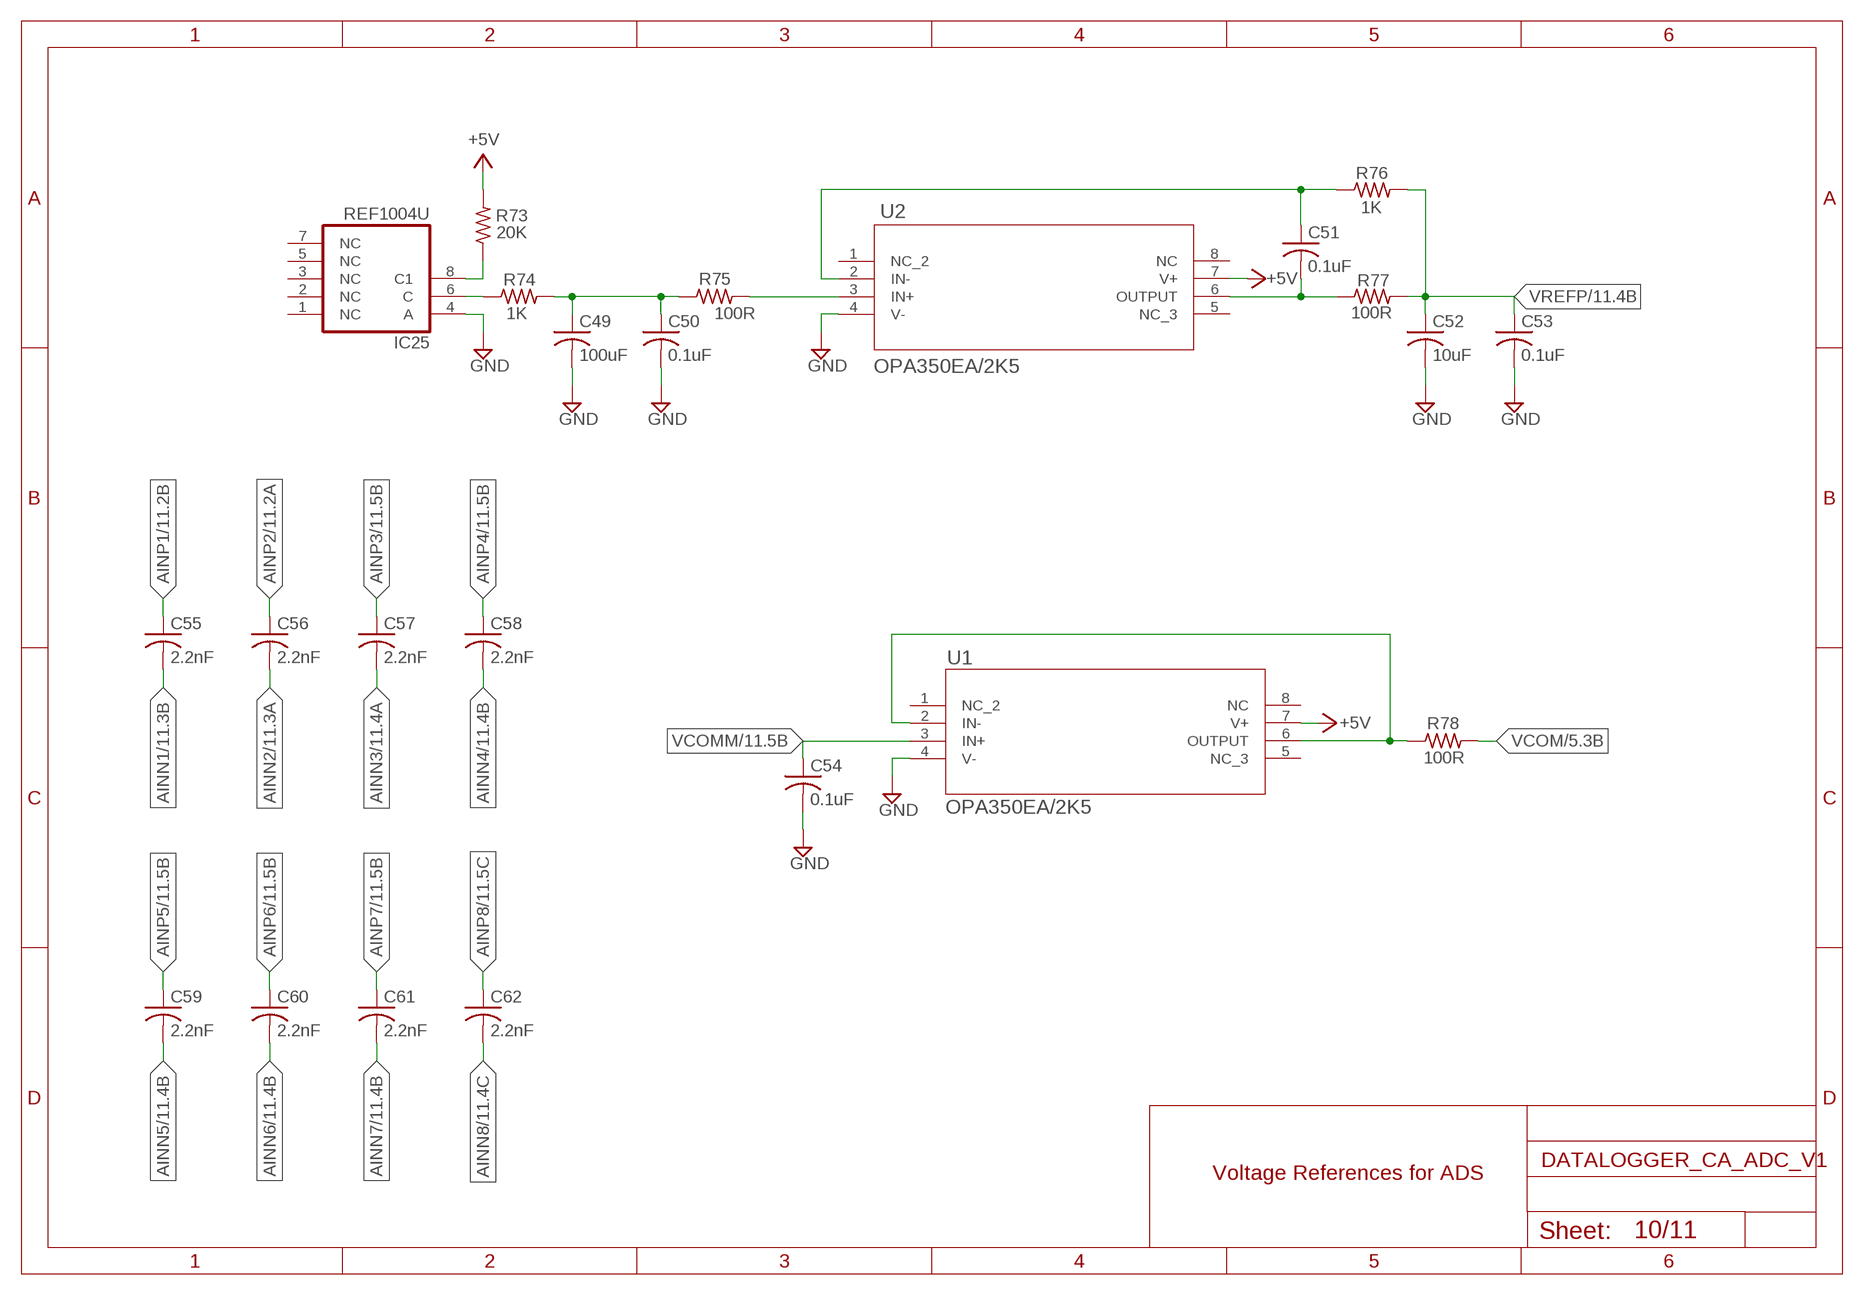
[diagram p9: schematic, sheet 10]

### Parts
C49  100uF  C-USC0805  [C0805]
C50  0.1uF  C-USC0805  [C0805]
C51  0.1uF  C-USC0805  [C0805]
C52  10uF  C-USC0805  [C0805]
C53  0.1uF  C-USC0805  [C0805]
C54  0.1uF  C-USC0805  [C0805]
C55  2.2nF  C-USC0805  [C0805]
C56  2.2nF  C-USC0805  [C0805]
C57  2.2nF  C-USC0805  [C0805]
C58  2.2nF  C-USC0805  [C0805]
C59  2.2nF  C-USC0805  [C0805]
C60  2.2nF  C-USC0805  [C0805]
C61  2.2nF  C-USC0805  [C0805]
C62  2.2nF  C-USC0805  [C0805]
IC25  REF1004U  [SO08]
R73  20K  R-US_R0805  [R0805]
R74  1K  R-US_R0805  [R0805]
R75  100R  R-US_R0805  [R0805]
R76  1K  R-US_R0805  [R0805]
R77  100R  R-US_R0805  [R0805]
R78  100R  R-US_R0805  [R0805]
U1  OPA350EA/2K5  [DGK8_TEX]
U2  OPA350EA/2K5  [DGK8_TEX]

### Nets
+5V: R73.2 U1.7(V+) U2.7(V+) ; also sheet 1,2,3,4,9,11
AINN1: C55.2 ; also sheet 5,11
AINN2: C56.2 ; also sheet 7,11
AINN3: C57.2 ; also sheet 6,11
AINN4: C58.2 ; also sheet 6,11
AINN5: C59.2 ; also sheet 5,11
AINN6: C60.2 ; also sheet 8,11
AINN7: C61.2 ; also sheet 8,11
AINN8: C62.2 ; also sheet 7,11
AINP1: C55.1 ; also sheet 5,11
AINP2: C56.1 ; also sheet 7,11
AINP3: C57.1 ; also sheet 6,11
AINP4: C58.1 ; also sheet 6,11
AINP5: C59.1 ; also sheet 5,11
AINP6: C60.1 ; also sheet 8,11
AINP7: C61.1 ; also sheet 8,11
AINP8: C62.1 ; also sheet 7,11
GND: C49.2 C50.2 C52.2 C53.2 C54.2 IC25.4(A) U1.4(V-) U2.4(V-) ; also sheet 1,2,3,4,5,6,7,8,9,11
N$65: IC25.8(C1) R73.1
N$66: IC25.6(C) R74.1
N$67: C49.1 C50.1 R74.2 R75.1
N$68: R75.2 U2.3(IN+)
N$69: C51.2 R77.1 U2.6(OUTPUT)
N$70: C51.1 R76.1 U2.2(IN-)
N$72: R78.1 U1.2(IN-) U1.6(OUTPUT)
VCOM: R78.2 ; also sheet 5,6,7,8
VCOMM: C54.1 U1.3(IN+) ; also sheet 11
VREFP: C52.1 C53.1 R76.2 R77.2 ; also sheet 11
Unconnected: IC25.1(NC) IC25.2(NC) IC25.3(NC) IC25.5(NC) IC25.7(NC) U1.1(NC_2) U1.5(NC_3) U1.8(NC) U2.1(NC_2) U2.5(NC_3) U2.8(NC)

### Notes on the sheet
- Voltage References for ADS

## Sheet 11 of 11
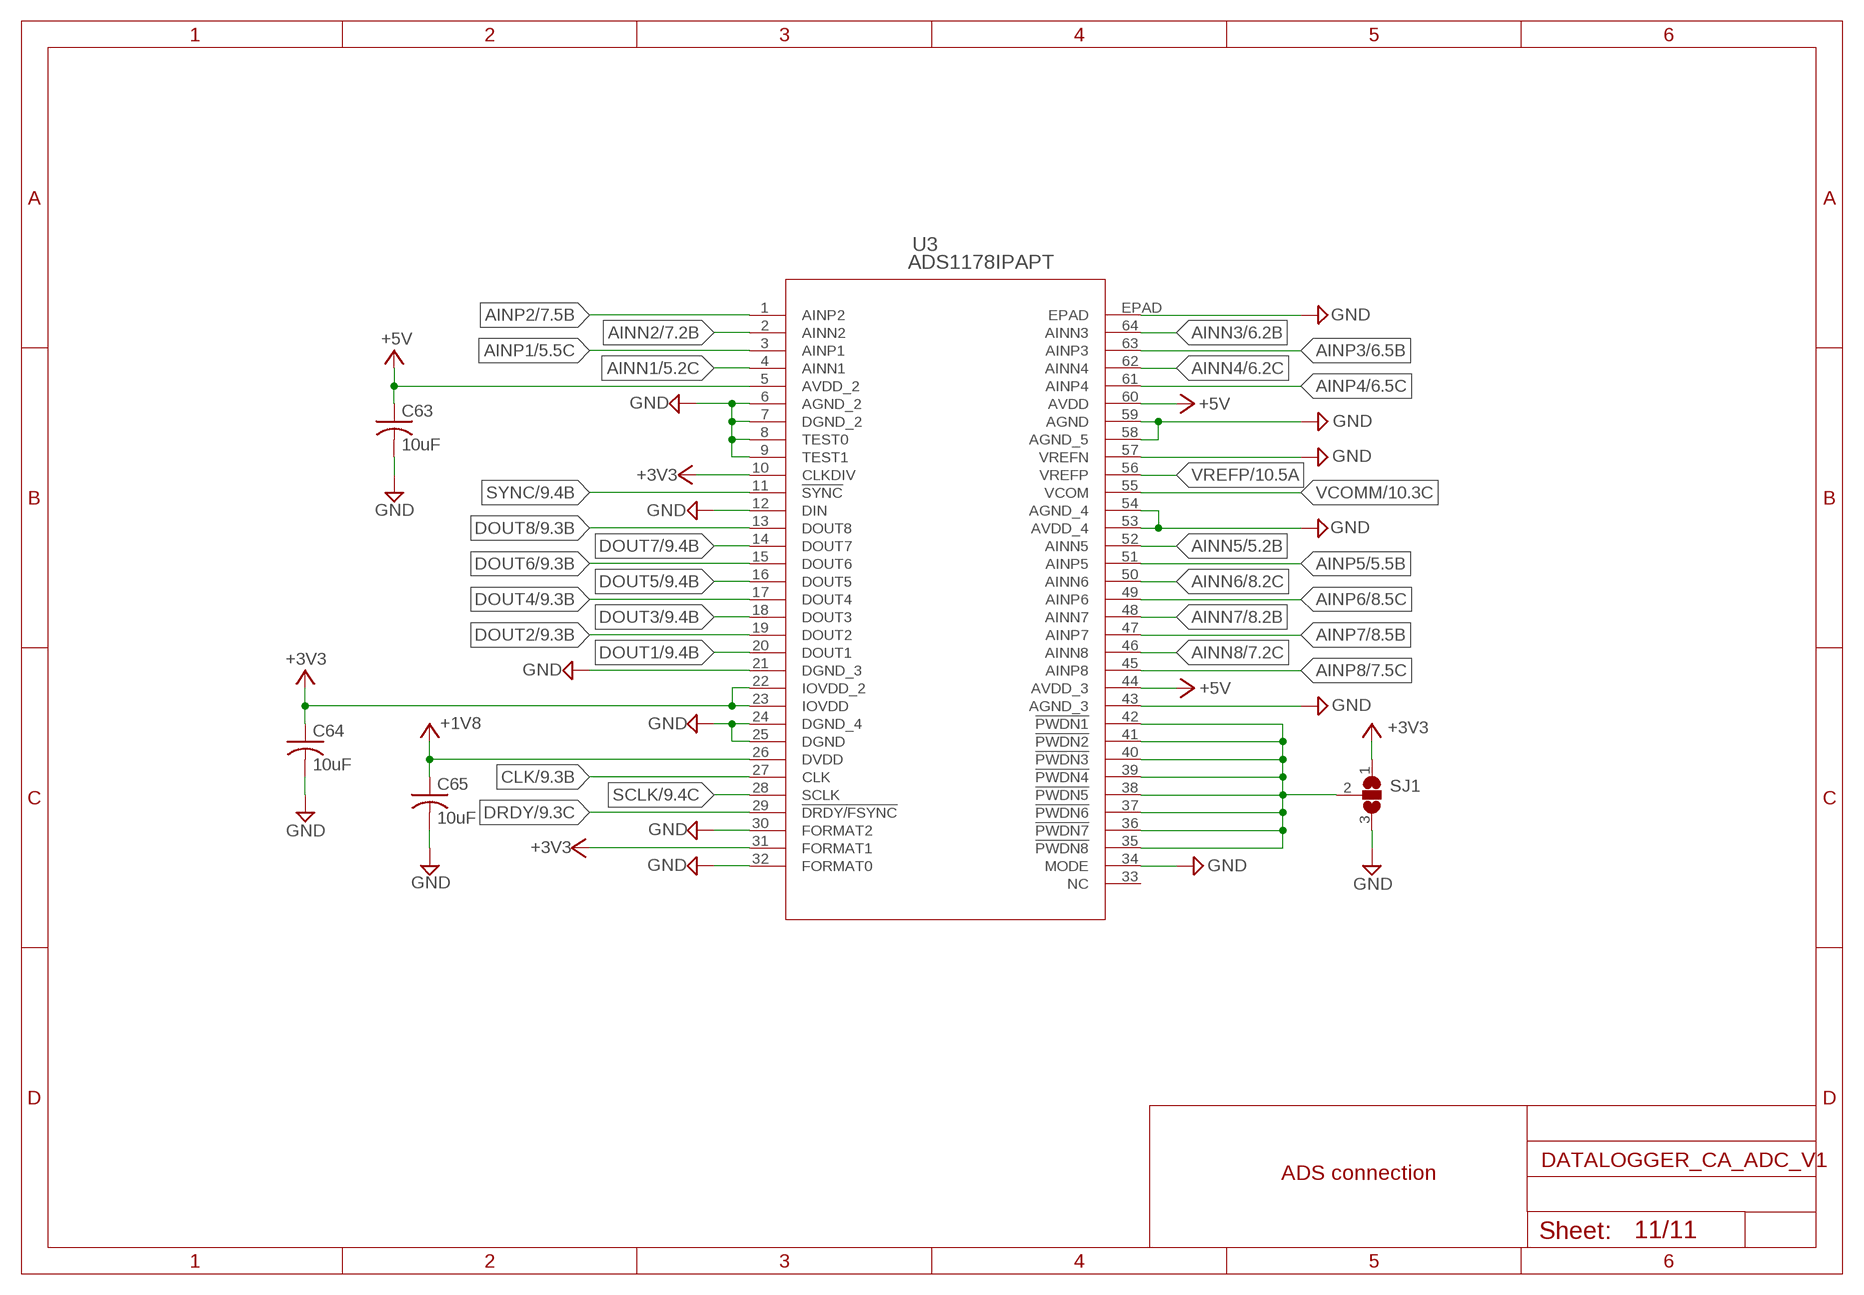
[diagram p10: schematic, sheet 11]

### Parts
C63  10uF  C-USC0805  [C0805]
C64  10uF  C-USC0805  [C0805]
C65  10uF  C-USC0805  [C0805]
SJ1  SJ2W  [SJ_2]
U3  ADS1178IPAPT  [PAP64_TEX]

### Nets
+1V8: C65.1 U3.26(DVDD) ; also sheet 9
+3V3: C64.1 SJ1.1 U3.10(CLKDIV) U3.22(IOVDD_2) U3.23(IOVDD) U3.31(FORMAT1) ; also sheet 9
+5V: C63.1 U3.5(AVDD_2) U3.44(AVDD_3) U3.60(AVDD) ; also sheet 1,2,3,4,9,10
AINN1: U3.4(AINN1) ; also sheet 5,10
AINN2: U3.2(AINN2) ; also sheet 7,10
AINN3: U3.64(AINN3) ; also sheet 6,10
AINN4: U3.62(AINN4) ; also sheet 6,10
AINN5: U3.52(AINN5) ; also sheet 5,10
AINN6: U3.50(AINN6) ; also sheet 8,10
AINN7: U3.48(AINN7) ; also sheet 8,10
AINN8: U3.46(AINN8) ; also sheet 7,10
AINP1: U3.3(AINP1) ; also sheet 5,10
AINP2: U3.1(AINP2) ; also sheet 7,10
AINP3: U3.63(AINP3) ; also sheet 6,10
AINP4: U3.61(AINP4) ; also sheet 6,10
AINP5: U3.51(AINP5) ; also sheet 5,10
AINP6: U3.49(AINP6) ; also sheet 8,10
AINP7: U3.47(AINP7) ; also sheet 8,10
AINP8: U3.45(AINP8) ; also sheet 7,10
CLK: U3.27(CLK) ; also sheet 9
DOUT1: U3.20(DOUT1) ; also sheet 9
DOUT2: U3.19(DOUT2) ; also sheet 9
DOUT3: U3.18(DOUT3) ; also sheet 9
DOUT4: U3.17(DOUT4) ; also sheet 9
DOUT5: U3.16(DOUT5) ; also sheet 9
DOUT6: U3.15(DOUT6) ; also sheet 9
DOUT7: U3.14(DOUT7) ; also sheet 9
DOUT8: U3.13(DOUT8) ; also sheet 9
DRDY: U3.29(!DRDY/FSYNC) ; also sheet 9
GND: C63.2 C64.2 C65.2 SJ1.3 U3.6(AGND_2) U3.7(DGND_2) U3.8(TEST0) U3.9(TEST1) U3.12(DIN) U3.21(DGND_3) U3.24(DGND_4) U3.25(DGND) U3.30(FORMAT2) U3.32(FORMAT0) U3.34(MODE) U3.43(AGND_3) U3.53(AVDD_4) U3.54(AGND_4) U3.57(VREFN) U3.58(AGND_5) U3.59(AGND) U3.EPAD ; also sheet 1,2,3,4,5,6,7,8,9,10
N$121: SJ1.2 U3.35(!PWDN8) U3.36(!PWDN7) U3.37(!PWDN6) U3.38(!PWDN5) U3.39(!PWDN4) U3.40(!PWDN3) U3.41(!PWDN2) U3.42(!PWDN1)
SCLK: U3.28(SCLK) ; also sheet 9
SYNC: U3.11(!SYNC) ; also sheet 9
VCOMM: U3.55(VCOM) ; also sheet 10
VREFP: U3.56(VREFP) ; also sheet 10
Unconnected: U3.33(NC)

### Notes on the sheet
- ADS connection

## Library data of the parts
C1-C65 = rcl:C-US: CAPACITOR, American symbol; SPICEPREFIX: C
IC1 IC2 IC5 IC7 IC9 IC11 IC13 IC15 = SamacSys_Parts:TLV2771CDBVR: Single 2.7-V High Slew Rate Rail-to-Rail Output Operational Amplifier Source: Datasheet <http://www.ti.com/lit/gpn/tlv2771>; DESCRIPTION: Single 2.7-V High Slew Rate Rail-to-Rail Output Operational Amplifier; HEIGHT: 1.45mm; MANUFACTURER_NAME: Texas Instruments; MANUFACTURER_PART_NUMBER: TLV2771CDBVR; MOUSER_PART_NUMBER: 595-TLV2771CDBVR; MOUSER_PRICE-STOCK: https://www.mouser.co.uk/ProductDetail/Texas-Instruments/TLV2771CDBVR?qs=Fg5TsMy7H4uETShD0%252BZIjw%3D%3D
IC3 IC4 IC6 IC8 IC10 IC12 IC14 IC16 = linear:MCP601: Single Op Amp 2.7V to 6.0V Single Supply CMOS Source: http://ww1.microchip.com/downloads/en/DeviceDoc/21314g.pdf
IC17-IC24 = SamacSys_Parts:OPA1632DR: OPA1632 High-Performance, Fully-Differential Audio Operational Amplifier Source: Datasheet <http://www.ti.com/general/docs/suppproductinfo.tsp?distId=10&gotoUrl=http://www.ti.com/lit/gpn/opa1632>; DESCRIPTION: OPA1632 High-Performance, Fully-Differential Audio Operational Amplifier; HEIGHT: 1.75mm; MANUFACTURER_NAME: Texas Instruments; MANUFACTURER_PART_NUMBER: OPA1632DR; MOUSER_PART_NUMBER: 595-OPA1632DR; MOUSER_PRICE-STOCK: https://www.mouser.com/Search/Refine.aspx?Keyword=595-OPA1632DR
IC25 = burr-brown:REF1004: Micropower Voltage Reference; MF: TEXAS INSTRUMENTS; MPN: REF1004C-1.2; OC_FARNELL: 1296022; OC_NEWARK: 75C7399
J1-J8 = SamacSys_Parts:1711026: CONNECTOR Phoenix Contact PCB Terminal Block, 2 Way, 30 12 AWG, Polyamide, 630 V Source: Datasheet <https://componentsearchengine.com/Datasheets/1/1711026.pdf>; DESCRIPTION: CONNECTOR Phoenix Contact PCB Terminal Block, 2 Way, 30 12 AWG, Polyamide, 630 V; HEIGHT: 18mm; MANUFACTURER_NAME: Phoenix Contact; MANUFACTURER_PART_NUMBER: 1711026; MOUSER_PART_NUMBER: 651-1711026; MOUSER_PRICE-STOCK: https://www.mouser.com/Search/Refine.aspx?Keyword=651-1711026
JP1 JP2 = pinhead:PINHD-2X10: PIN HEADER
R1-R78 = rcl:R-US_: RESISTOR, American symbol; SPICEPREFIX: R
SJ1 = jumper:SJ2W: SMD solder JUMPER
U1 U2 = OPA350EA_2K5:OPA350EA/2K5; BUILT_BY: EMA_UL_Team; COPYRIGHT: Copyright (C) 2018 Accelerated Designs. All rights reserved; MANUFACTURER: Texas Instruments; MANUFACTURER_PART_NUMBER: OPA350EA/2K5; SOURCELIBRARY: TI_2016-07-06; VENDOR: Texas Instruments
U3 = ADS1178IPAPT:ADS1178IPAPT; BUILT_BY: EMA_UL_Team; MANUFACTURER_PART_NUMBER: ADS1178IPAPT; SOURCELIBRARY: TI_2015-1-6; VENDOR: Texas Instruments

## Board
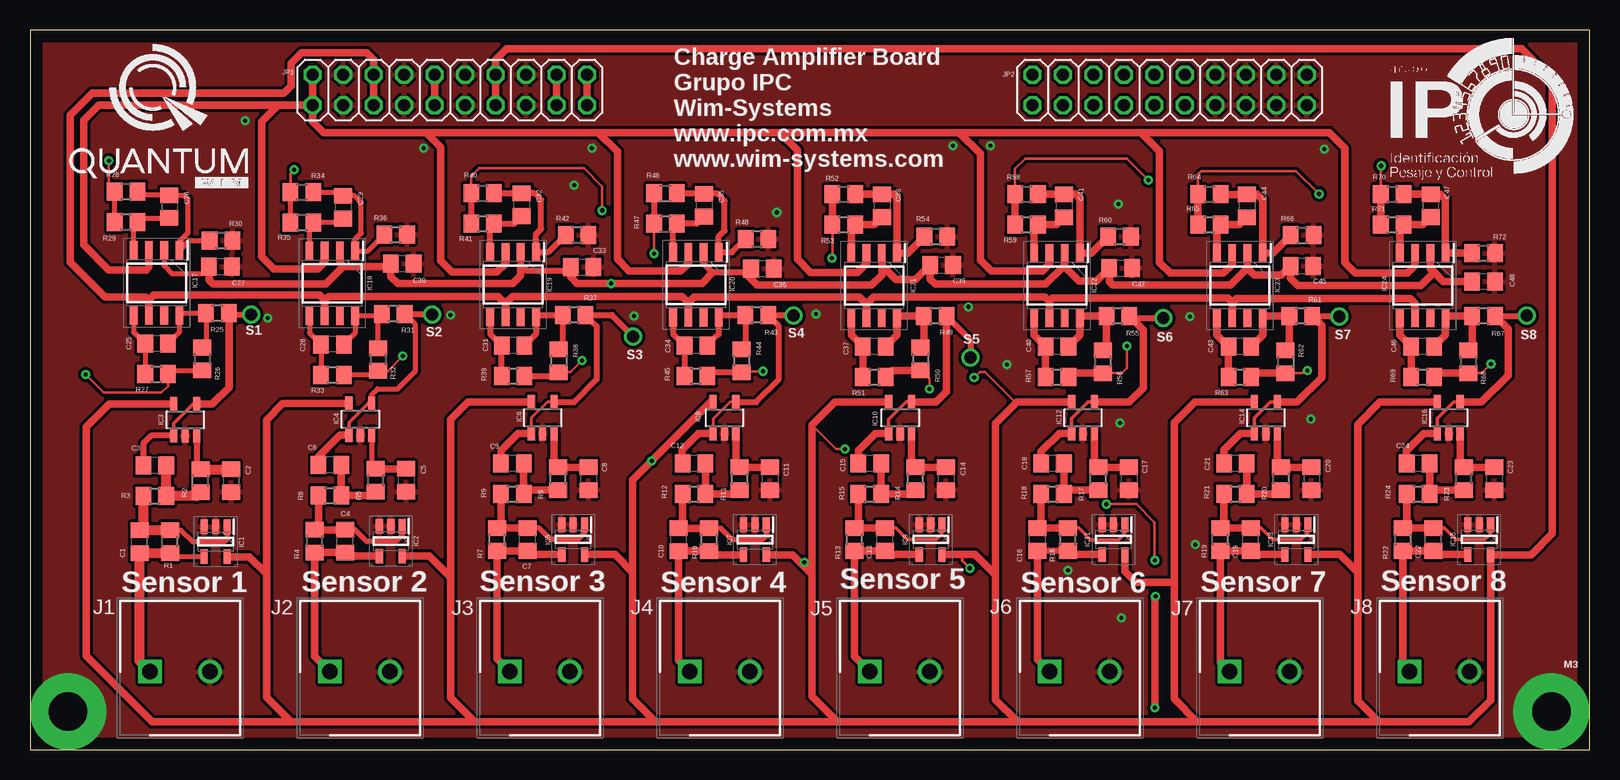
[diagram p11: board, top side]
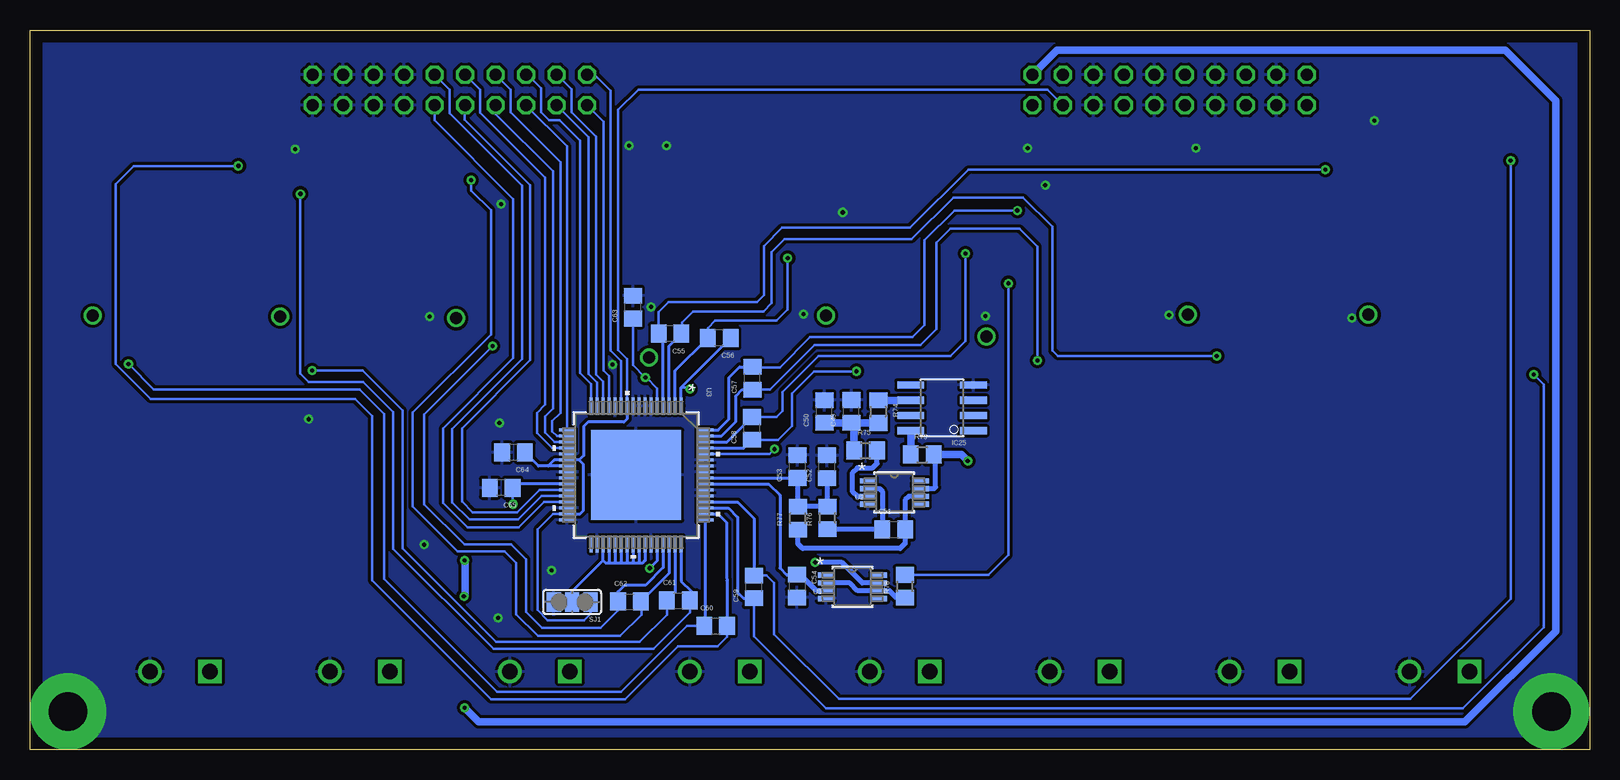
[diagram p12: board, bottom side, seen from below]

Size 130 x 60 mm. Coordinates in mm from the lower left corner, seen from the top.
Outline: 0,0 130,0 130,60 0,60 0,0
Copper layers (1*16): Top 0.035mm / dielectric 1.5mm / Bottom 0.035mm
Design rules "default": minimum track width 6mil, minimum drill 0.35mm, track to track 6mil, track to pad 6mil, pad to pad 6mil, via to via 6mil, smd to smd 6mil, copper to edge 40mil, drill to drill 6mil, minimum pad ring 10mil, minimum via ring 8mil, stop-mask expansion 4mil, vias tented up to drill 0mil, thermal gap 10mil

### Footprints (pad centres in the part's own frame; a part is rotated, then mirrored left to right if it is on the bottom)
C0805 = smd 1.3 x 1.5: 1 -0.95,0; 2 0.95,0
SOT95P280X145-5N = smd 1.2 x 0.6: 1 -1.25,0.95; 2 -1.25,0; 3 -1.25,-0.95; 4 1.25,-0.95; 5 1.25,0.95
SOT23-5 = smd 0.6 x 1.2: 1 -0.95,-1.306; 2 0,-1.306; 3 0.95,-1.306; 4 0.95,1.306; 5 -0.95,1.306
SOIC127P600X175-8N = smd 1.528 x 0.65: 1 -2.711,1.905; 2 -2.711,0.635; 3 -2.711,-0.635; 4 -2.711,-1.905; 5 2.711,-1.905; 6 2.711,-0.635; 7 2.711,0.635; 8 2.711,1.905
SO08 = smd 0.61 x 2.21: 1 -1.905,-2.616; 2 -0.635,-2.616; 3 0.635,-2.616; 4 1.905,-2.616; 5 1.905,2.616; 6 0.635,2.616; 7 -0.635,2.616; 8 -1.905,2.616
SHDR2W110P0X500_1X2_1000X1120X = drill 1.3 pad 1.95 square: 1 0,0 | drill 1.3 pad 1.95: 2 5,0
2X10 = drill 1.016 octagon: 1 -11.43,-1.27; 2 -11.43,1.27; 3 -8.89,-1.27; 4 -8.89,1.27; 5 -6.35,-1.27; 6 -6.35,1.27; 7 -3.81,-1.27; 8 -3.81,1.27; 9 -1.27,-1.27; 10 -1.27,1.27; 11 1.27,-1.27; 12 1.27,1.27; 13 3.81,-1.27; 14 3.81,1.27; 15 6.35,-1.27; 16 6.35,1.27; 17 8.89,-1.27; 18 8.89,1.27; 19 11.43,-1.27; 20 11.43,1.27
R0805 = smd 1.3 x 1.5: 1 -0.95,0; 2 0.95,0
SJ_2 = smd 1.168 x 1.6: 1 -1.524,0; 2 0,0; 3 1.524,0
DGK8_TEX = smd 1.333 x 0.432: 1 -2.216,0.975; 2 -2.216,0.325; 3 -2.216,-0.325; 4 -2.216,-0.975; 5 2.216,-0.975; 6 2.216,-0.325; 7 2.216,0.325; 8 2.216,0.975
PAP64_TEX = smd 1.341 x 0.239: 1 -5.776,3.75; 2 -5.776,3.25; 3 -5.776,2.75; 4 -5.776,2.25; 5 -5.776,1.75; 6 -5.776,1.25; 7 -5.776,0.75; 8 -5.776,0.25; 9 -5.776,-0.25; 10 -5.776,-0.75; 11 -5.776,-1.25; 12 -5.776,-1.75; 13 -5.776,-2.25; 14 -5.776,-2.75; 15 -5.776,-3.25; 16 -5.776,-3.75; 33 5.776,-3.75; 34 5.776,-3.25; 35 5.776,-2.75; 36 5.776,-2.25; 37 5.776,-1.75; 38 5.776,-1.25; 39 5.776,-0.75; 40 5.776,-0.25; 41 5.776,0.25; 42 5.776,0.75; 43 5.776,1.25; 44 5.776,1.75; 45 5.776,2.25; 46 5.776,2.75; 47 5.776,3.25; 48 5.776,3.75 | smd 0.239 x 1.341: 17 -3.75,-5.776; 18 -3.25,-5.776; 19 -2.75,-5.776; 20 -2.25,-5.776; 21 -1.75,-5.776; 22 -1.25,-5.776; 23 -0.75,-5.776; 24 -0.25,-5.776; 25 0.25,-5.776; 26 0.75,-5.776; 27 1.25,-5.776; 28 1.75,-5.776; 29 2.25,-5.776; 30 2.75,-5.776; 31 3.25,-5.776; 32 3.75,-5.776; 49 3.75,5.776; 50 3.25,5.776; 51 2.75,5.776; 52 2.25,5.776; 53 1.75,5.776; 54 1.25,5.776; 55 0.75,5.776; 56 0.25,5.776; 57 -0.25,5.776; 58 -0.75,5.776; 59 -1.25,5.776; 60 -1.75,5.776; 61 -2.25,5.776; 62 -2.75,5.776; 63 -3.25,5.776; 64 -3.75,5.776 | smd 7.493 x 7.493: EPAD 0,0

### Placement (x,y rotation side)
C1  9.13,17.33 90 top
C2  16.75,22.41 270 top
C3  10.4,23.68 180 top
C4  26.27,17.38 90 top
C5  31.35,22.46 270 top
C6  25,23.73 180 top
C7  41.47,17.51 90 top
C8  46.55,22.59 270 top
C9  40.2,23.86 180 top
C10  54.08,17.5 90 top
C11  61.7,22.58 270 top
C12  55.35,23.85 180 top
C13  71.27,17.51 90 top
C14  76.35,22.59 270 top
C15  70,23.86 180 top
C16  83.97,17.51 90 top
C17  91.59,22.59 270 top
C18  85.24,23.86 180 top
C19  101.75,17.51 90 top
C20  106.83,22.59 270 top
C21  100.48,23.86 180 top
C22  116.99,17.51 90 top
C23  122.07,22.59 270 top
C24  115.72,23.86 180 top
C25  10.55,33.84 180 top
C26  11.62,45.27 270 top
C27  15.88,40.27 0 top
C28  25.2,33.79 180 top
C29  26.1,45.22 270 top
C30  31.03,40.53 0 top
C31  40.27,33.69 180 top
C32  40.99,45.43 270 top
C33  46.02,40.24 0 top
C34  55.51,33.68 180 top
C35  56.18,45.39 270 top
C36  61.05,40.1 0 top
C37  70.37,33.61 180 top
C38  71.01,45.35 270 top
C39  75.99,40.4 0 top
C40  85.61,33.61 180 top
C41  86.2,45.34 270 top
C42  90.91,40.16 0 top
C43  100.85,33.61 180 top
C44  101.45,45.34 270 top
C45  106.02,40.33 0 top
C46  116.09,33.61 180 top
C47  116.75,45.35 270 top
C48  121.17,39.04 0 top
C49  61.54,28.2 90 bottom
C50  63.79,28.19 90 bottom
C51  58,18.35 0 bottom
C52  63.55,23.58 90 bottom
C53  66.02,23.6 90 bottom
C54  66.07,13.62 270 bottom
C55  76.65,34.67 180 bottom
C56  72.55,34.31 180 bottom
C57  69.79,30.96 90 bottom
C58  69.82,26.78 90 bottom
C59  69.65,13.56 90 bottom
C60  72.85,10.3 0 bottom
C61  75.96,12.42 0 bottom
C62  80.03,12.34 0 bottom
C63  79.74,36.89 90 bottom
C64  89.7,24.78 180 bottom
C65  90.72,21.83 180 bottom
IC1  15.48,17.33 270 top
IC2  30.08,17.38 270 top
IC3  12.94,27.49 0 top
IC4  27.54,27.54 0 top
IC5  45.28,17.51 270 top
IC6  42.74,27.67 0 top
IC7  60.43,17.5 270 top
IC8  57.89,27.66 0 top
IC9  75.08,17.51 270 top
IC10  72.54,27.67 0 top
IC11  90.32,17.51 270 top
IC12  87.78,27.67 0 top
IC13  105.56,17.51 270 top
IC14  103.02,27.67 0 top
IC15  120.8,17.51 270 top
IC16  118.26,27.67 0 top
IC17  10.55,38.92 270 top
IC18  25.2,38.87 270 top
IC19  40.27,38.77 270 top
IC20  55.51,38.76 270 top
IC21  70.37,38.69 270 top
IC22  85.61,38.69 270 top
IC23  100.85,38.69 270 top
IC24  116.09,38.69 270 top
IC25  53.97,28.49 90 bottom
J1  10,6.5 0 top
J2  25,6.5 0 top
J3  40,6.5 0 top
J4  55,6.5 0 top
J5  70,6.5 0 top
J6  85,6.5 0 top
J7  100,6.5 0 top
J8  115,6.5 0 top
JP1  35,55 0 top
JP2  95,55 0 top
R1  11.67,17.33 90 top
R2  14.21,22.41 90 top
R3  10.4,21.14 0 top
R4  23.73,17.38 90 top
R5  28.81,22.46 90 top
R6  25,21.19 0 top
R7  38.93,17.51 90 top
R8  44.01,22.59 90 top
R9  40.2,21.32 0 top
R10  56.62,17.5 90 top
R11  59.16,22.58 90 top
R12  55.35,21.31 0 top
R13  68.73,17.51 90 top
R14  73.81,22.59 90 top
R15  70,21.32 0 top
R16  86.51,17.51 90 top
R17  89.05,22.59 90 top
R18  85.24,21.32 0 top
R19  99.21,17.51 90 top
R20  104.29,22.59 90 top
R21  100.48,21.32 0 top
R22  114.45,17.51 90 top
R23  119.53,22.59 90 top
R24  115.72,21.32 0 top
R25  15.63,36.38 180 top
R26  14.36,32.57 270 top
R27  10.55,31.3 0 top
R28  8.01,46.54 0 top
R29  8.01,44 0 top
R30  15.93,42.45 0 top
R31  30.28,36.33 180 top
R32  29.01,32.52 270 top
R33  25.2,31.25 0 top
R34  22.66,46.49 0 top
R35  22.66,43.95 0 top
R36  30.49,42.94 0 top
R37  45.35,36.23 180 top
R38  44.08,32.42 270 top
R39  40.27,31.15 0 top
R40  37.73,46.39 0 top
R41  37.73,43.85 0 top
R42  45.6,42.91 0 top
R43  60.59,36.22 180 top
R44  59.32,32.41 270 top
R45  55.51,31.14 0 top
R46  52.97,46.38 0 top
R47  52.97,43.84 0 top
R48  60.6,42.58 0 top
R49  75.45,36.15 180 top
R50  74.23,32.57 270 top
R51  70.37,31.07 0 top
R52  67.83,46.31 0 top
R53  67.83,43.77 0 top
R54  75.51,42.79 0 top
R55  90.69,36.15 180 top
R56  89.42,32.34 270 top
R57  85.61,31.07 0 top
R58  83.07,46.31 0 top
R59  83.07,43.77 0 top
R60  90.82,42.79 0 top
R61  105.93,36.15 180 top
R62  104.66,32.34 270 top
R63  100.85,31.07 0 top
R64  98.31,46.31 0 top
R65  98.31,43.77 0 top
R66  106.04,42.88 0 top
R67  121.17,36.15 180 top
R68  119.9,32.34 270 top
R69  116.09,31.07 0 top
R70  113.55,46.31 0 top
R71  113.55,43.77 0 top
R72  121.17,41.39 0 top
R73  55.63,24.59 0 bottom
R74  59.29,28.18 270 bottom
R75  60.35,24.93 0 bottom
R76  63.52,19.31 90 bottom
R77  66,19.3 90 bottom
R78  57.07,13.61 90 bottom
SJ1  84.81,12.3 180 bottom
U1  61.44,13.56 0 bottom
U2  57.95,21.43 0 bottom
U3  79.47,22.89 270 bottom

### Tracks (layer width: path | path; a pad name or v marks a point on that pad's centre or on a via)
+1V8  (via drill 0.35)
  Top 0.203: v89.74,20.46 92.21,20.46 93.74,18.93 93.74,15.78 v93.76,15.76
  Top 0.61: JP1.20 JP1.19 | v93.77,3.49 93.77,12.71 v93.83,12.77
  Bottom 0.203: C65.1 89.77,20.49 v89.74,20.46
  Bottom 0.254: U3.26 89.46,22.14
  Bottom 0.508: 89.46,22.14 C65.1
  Bottom 0.61: JP1.20 44.4,58.3 7.03,58.3 2.83,54.1 2.83,9.87 10.38,2.32 92.6,2.32 v93.77,3.49 | v93.76,15.76 93.74,15.74 93.74,12.86 v93.83,12.77
+3V3
  Top 0.61: JP1.18 JP1.17
  Bottom 0.203: JP1.17 45.2,55.04 79.28,55.04 80.97,53.35 80.97,33.33 80.22,32.58 U3.10 | U3.31 86.41,19.64 87.7,18.35 87.7,11.63 86.84,10.77 83.81,10.77 83.29,11.29 SJ1.1
  Bottom 0.254: U3.23 86.8,23.64 | 86.8,23.64 87.61,23.64 C64.1 | 86.8,23.64 86.3,24.14 U3.22 84.22,24.14 | U3.10 80.22,27.58 80.49,27.31 83.49,27.31 83.85,26.95 83.85,24.51 84.22,24.14 | U3.31 84.15,19.64 83.87,19.92 83.87,23.79 84.22,24.14
+5V  (via drill 0.35)
  Top 0.203: v78.71,31.02 79.18,31.49 79.61,31.49 82.12,28.98 82.28,28.98 | v67.94,25.05 67.19,25.05 65.19,27.05
  Top 0.254: v78.34,15.12 77.72,15.74 77.72,16.26
  Top 0.406: v64.55,15.6 65.19,15.6
  Top 0.61: JP1.13 JP1.14 38.81,57.53 39.72,58.44 124.35,58.44 126.9,55.89 126.9,18.02 125.13,16.25 IC15.5 121.75,4.12 119.94,2.31 112.45,2.31 | IC1.5 18.29,16.08 19.72,14.65 | 19.72,14.65 19.72,4.37 21.78,2.31 | 21.78,2.31 37.06,2.31 | 37.06,2.31 52.15,2.31 | 52.15,2.31 67.32,2.31 | 67.32,2.31 82.34,2.31 | 82.34,2.31 97.29,2.31 | 97.29,2.31 112.45,2.31 | IC4.5 21.08,28.85 19.72,27.49 19.72,14.65 | IC6.5 36.51,28.98 35.07,27.54 35.07,14.34 | 35.07,14.34 35.07,4.3 37.06,2.31 | IC2.5 33.28,16.13 35.07,14.34 | IC8.5 56.71,28.97 51.83,24.08 v51.83,24.06 50.24,22.47 50.24,14.77 | 50.24,14.77 50.24,4.22 52.15,2.31 | IC5.5 48.75,16.26 50.24,14.77 | IC10.5 67.12,28.98 65.19,27.05 65.19,15.6 65.19,14.62 | 65.19,14.62 65.19,4.44 67.32,2.31 | IC7.5 63.56,16.25 65.19,14.62 | IC12.5 82.28,28.98 80.49,27.19 80.49,14.55 | 80.49,14.55 80.49,4.16 82.34,2.31 | IC9.5 77.72,16.26 78.78,16.26 80.49,14.55 | IC14.5 97.1,28.98 95.38,27.26 95.38,14.03 | 95.38,14.03 95.38,4.22 97.29,2.31 | IC16.5 112.54,28.98 110.68,27.12 110.68,14.77 | 110.68,14.77 110.68,4.08 112.45,2.31 | IC13.5 109.19,16.26 110.68,14.77 | IC3.5 6.59,28.8 4.67,26.88 4.67,7.83 10.19,2.31 21.78,2.31 | IC11.5 91.27,14.85 92.19,13.93 95.28,13.93 95.38,14.03
  Bottom 0.203: U3.60 68.35,24.64 v67.94,25.05 | U3.5 77.72,30.12 78.62,31.02 v78.71,31.02 79.74,32.05 C63.1
  Bottom 0.254: U3.44 77.72,15.74 v78.34,15.12
  Bottom 0.406: U2.7 54.65,21.75 54.52,21.88 54.52,24.43 R73.2 | U1.7 60.6,13.88 62.32,15.6 v64.55,15.6
  Bottom 0.61: R73.2 52.36,24.59 v51.83,24.06
+12V
  Top 0.61: JP1.2 JP1.1 | JP1.1 20.69,53.73 | 20.69,53.73 5.72,53.73 4.47,52.48 4.47,42.09 6.57,39.99 9.67,39.99 9.91,40.23 IC17.3 | IC18.3 24.57,40.65 23.97,40.05 20.37,40.05 19.3,41.12 19.3,52.34 20.69,53.73 | IC19.3 39.63,40.53 38.9,39.8 35.2,39.8 34.24,40.76 34.24,50.22 33.01,51.45 | 33.01,51.45 24.49,51.45 23.57,52.37 JP1.1 | IC20.3 54.88,40.53 54.24,39.9 49.95,39.9 48.97,40.88 48.97,49.85 47.37,51.45 | 47.37,51.45 33.01,51.45 | IC21.3 69.73,40.53 68.98,39.78 65.08,39.78 63.96,40.9 63.96,49.98 62.49,51.45 | 62.49,51.45 47.37,51.45 | IC22.3 84.97,40.48 84.38,39.89 80.15,39.89 79.21,40.83 79.21,49.69 77.45,51.45 | 77.45,51.45 62.49,51.45 | IC23.3 100.22,40.44 99.49,39.71 95.06,39.71 94.16,40.61 94.16,49.88 92.59,51.45 | 92.59,51.45 77.45,51.45 | IC24.3 115.45,40.37 114.8,39.71 110.48,39.71 109.6,40.59 109.6,50.16 108.31,51.45 92.59,51.45
+24V
  Top 0.61: JP1.10 JP1.9
-12V
  Top 0.61: JP1.5 JP1.6 28.65,57.53 28.07,58.11 22.65,58.11 21.79,57.25 21.79,55.37 21.14,54.72 5.19,54.72 3.35,52.88 3.35,40.63 6.25,37.73 9.66,37.73 9.91,37.48 | IC17.6 9.91,37.48 | IC18.6 24.57,37.47 | 24.57,37.47 24.14,37.89 10.33,37.89 9.91,37.48 | IC19.6 39.63,37.2 | 39.63,37.2 39.04,37.79 24.89,37.79 24.57,37.47 | IC20.6 54.88,37.28 | 54.88,37.28 54.37,37.79 40.23,37.79 39.63,37.2 | IC21.6 69.73,37.16 | 69.73,37.16 69.14,37.75 55.34,37.75 54.88,37.28 | IC22.6 84.97,37.4 | 84.97,37.4 84.62,37.75 70.33,37.75 69.73,37.16 | IC23.6 100.22,37.27 | 100.22,37.27 99.84,37.65 85.23,37.65 84.97,37.4 | IC24.6 115.45,37.23 115.07,37.62 100.56,37.62 100.22,37.27
AINN1  (via drill 0.35)
  Top 0.203: R34.1 21.71,48.05 v22.01,48.35
  Top 0.406: R35.1 R34.1
  Bottom 0.203: v22.01,48.35 51.79,48.35 56.63,43.51 67.3,43.51 68.83,41.98 68.83,37.9 69.41,37.32 76.78,37.32 77.6,36.5 C55.2
  Bottom 0.254: U3.4 77.22,34.29 C55.2
AINN2  (via drill 0.35)
  Top 0.203: R53.1 66.88,41.02 v66.84,40.98
  Top 0.61: R52.1 R53.1
  Bottom 0.203: v66.84,40.98 66.84,36.69 67.77,35.76 72.88,35.76 73.5,35.14 C56.2
  Bottom 0.254: U3.2 76.22,31.59 C56.2
AINN3  (via drill 0.35)
  Top 0.203: R40.1 36.78,47.81 37.43,48.46 46.17,48.46 47.7,46.93 v47.7,44.95
  Top 0.508: R40.1 R41.1
  Bottom 0.203: v47.7,44.95 52.95,44.95 55.44,42.46 55.44,35.38 56.43,34.39 64.96,34.39 67.48,31.87 69.75,31.87 C57.2
  Bottom 0.254: U3.64 72.64,26.64 71.73,27.55 71.73,31.02 70.84,31.91 C57.2
AINN4  (via drill 0.35)
  Top 0.203: R47.1 v52.02,41.37 v52.03,41.36
  Top 0.508: R46.1 R47.1
  Bottom 0.203: v52.03,41.36 52.03,34.06 53.26,32.83 64.27,32.83 67.27,29.83 67.27,28.24 67.78,27.73 C58.2
  Bottom 0.254: U3.62 71.91,25.64 C58.2
AINN5  (via drill 0.35)
  Top 0.203: R28.1 6.58,47.02 v6.58,49.09
  Top 0.406: R29.1 R28.1
  Bottom 0.203: v6.58,49.09 6.58,12.56 14.93,4.21 62.58,4.21 67.97,9.6 67.97,13.9 68.6,14.53 69.63,14.53
  Bottom 0.254: U3.52 71.01,20.64 69.63,19.26 69.63,14.53 C59.2
AINN6  (via drill 0.35)
  Top 0.203: R70.1 112.6,48.63 v112.63,48.66
  Top 0.61: R71.1 R70.1
  Bottom 0.203: v112.63,48.66 121.33,48.66 122.87,47.13 122.87,32.15 119.95,29.23 102.9,29.23 101.47,27.8 101.47,14.12 91.55,4.2 80.39,4.2 75.98,8.61 72.68,8.61 71.9,9.39 C60.2
  Bottom 0.254: U3.50 72.64,19.64 71.93,18.93 71.93,14.43 71.9,14.07 C60.2
AINN7  (via drill 0.35)
  Top 0.203: R64.1 97.36,47.96 97.65,48.25 105.54,48.25 v107.46,46.33
  Top 0.61: R64.1 R65.1
  Bottom 0.203: v107.46,46.33 107.46,31.34 106.77,30.65 102.23,30.65 99.72,28.14 99.72,16.75 91.35,8.38 78.04,8.38 74.99,11.43 74.99,12.4 C61.2
  Bottom 0.254: U3.48 75.72,14.03 74.9,13.21 74.9,12.53 C61.2
AINN8  (via drill 0.35)
  Top 0.203: R58.1 82.12,48.42 82.98,49.28 91.43,49.28 v93.23,47.48
  Top 0.61: R59.1 R58.1
  Bottom 0.203: v93.23,47.48 93.23,46.62 91.58,44.97 91.58,34.61 98.09,28.1 98.09,20.27 94.35,16.53 90.43,16.53 89.46,15.56 89.46,11.29 87.63,9.46 80.83,9.46 79.04,11.25 79.04,12.31
  Bottom 0.254: U3.46 76.72,14.7 C62.2
  Bottom 0.305: 79.04,12.31 C62.2
AINP1  (via drill 0.35)
  Top 0.203: R32.2 29.84,31.57 v31.08,32.81
  Top 0.406: R32.2 28.69,31.25 R33.2
  Bottom 0.203: v31.08,32.81 44.32,32.81 44.78,33.27 44.78,43.59 47.22,46.03 53.04,46.03 56.52,42.55 67.11,42.55 68.17,41.49 68.17,37.21 68.85,36.53 74.72,36.53 75.65,35.6 75.65,34.72 C55.1
  Bottom 0.254: U3.3 76.72,33.65 C55.1
AINP2  (via drill 0.35)
  Top 0.203: R50.2 74.97,30.88 v74.97,30.06
  Top 0.61: R51.2 71.87,31.62 R50.2
  Bottom 0.203: v74.97,30.06 75.1,30.19 75.72,30.19
  Bottom 0.254: U3.1 75.72,30.19 C56.1
AINP3  (via drill 0.35)
  Top 0.203: R38.2 45.05,31.47 v46.01,32.43
  Top 0.508: R39.2 43.76,31.15 R38.2
  Bottom 0.203: v46.01,32.43 46.01,41.92 47.53,43.44 53.26,43.44 54.44,42.26 54.44,35.07 55.79,33.72 64.59,33.72 68.3,30.01 C57.1
  Bottom 0.254: U3.63 72.36,26.14 71.16,27.34 71.16,29.49 70.64,30.01 C57.1
AINP4  (via drill 0.35)
  Top 0.203: R44.2 59.4,31.54 v61.11,31.54
  Top 0.508: R45.2 56.78,31.46 R44.2
  Bottom 0.203: v61.11,31.54 64.65,31.54 66.49,29.7 66.49,26.97 67.63,25.83 C58.1
  Bottom 0.254: U3.61 70.51,25.14 C58.1
AINP5  (via drill 0.35)
  Top 0.203: v4.65,31.27 6.14,29.78 10.95,29.78 11.5,30.33 R27.2
  Top 0.406: R27.2 11.82,31.62 R26.2
  Bottom 0.203: C59.1 69.65,9.44 63.66,3.45 10.56,3.45 3.81,10.2 3.81,30.43 v4.65,31.27
  Bottom 0.254: U3.51 71.79,20.14 71.01,19.36 71.01,13.1 70.52,12.61 C59.1
AINP6  (via drill 0.35)
  Top 0.203: R68.2 121.04,31.39 v121.79,32.14
  Top 0.61: R69.2 117.36,31.39 R68.2
  Bottom 0.203: v121.79,32.14 119.68,30.03 102.52,30.03 100.47,27.98 100.47,14.25 91.05,4.83 80.73,4.83 75.25,10.31 73.72,10.31 73.69,10.28
  Bottom 0.254: C60.1 73.8,10.23 73.74,10.21 73.69,10.16 73.69,10.28 U3.49
AINP7  (via drill 0.35)
  Top 0.203: R62.2 106.26,31.39 v106.48,31.61
  Top 0.61: R62.2 102.12,31.39 R63.2
  Bottom 0.203: v106.48,31.61 102.27,31.61 98.93,28.27 98.93,16.76 91.16,8.99 79.17,8.99 76.91,11.25 C61.1
  Bottom 0.254: U3.47 76.22,13.11 C61.1
AINP8  (via drill 0.35)
  Top 0.203: R56.2 91.02,31.39 91.44,31.81 v91.44,33.64
  Top 0.61: R57.2 86.88,31.39 R56.2
  Bottom 0.203: v91.44,33.64 97.14,27.94 97.14,20.45 93.78,17.09 89.88,17.09 88.66,15.87 88.66,11.48 87.32,10.14 82.43,10.14 80.98,11.59 C62.1
  Bottom 0.254: U3.45 77.22,15.18 78.7,13.7 80.43,13.7 80.98,13.15 C62.1
CLK
  Bottom 0.203: U3.27 87.54,21.64 89.4,19.78 93.1,19.78 94,20.68 94,26.79 88.32,32.47 88.32,47.08 93.76,52.52 93.76,53.7 JP2.9
DOUT1
  Bottom 0.203: U3.20 86.47,25.14 87.74,26.41 87.74,28.07 87.05,28.76 87.05,47.68 92.48,53.11 92.48,55.02 JP2.10
DOUT2
  Bottom 0.203: U3.19 86.29,25.64 87.07,26.42 87.07,27.76 86.4,28.43 86.4,48.21 91.19,53 JP2.7
DOUT3
  Bottom 0.203: U3.18 86.08,26.14 86.46,26.52 86.46,27.4 85.78,28.08 85.78,48.96 89.95,53.13 89.95,55.03 JP2.8
DOUT4
  Bottom 0.203: U3.17 85.25,50.3 88.65,53.7 JP2.5
DOUT5
  Bottom 0.203: U3.16 83.22,30.48 84.14,31.4 84.14,50.76 85.86,52.48 86.74,52.48 87.39,53.13 87.39,55.13 88.53,56.27 JP2.6
DOUT6
  Bottom 0.203: JP2.3 83.44,51.06 83.44,31.33 82.72,30.61 U3.15
DOUT7
  Bottom 0.203: U3.14 82.22,30.67 82.81,31.26 82.81,51.11 84.84,53.14 84.84,55.06 86.05,56.27 JP2.4
DOUT8
  Bottom 0.203: U3.13 81.72,31.15 82.19,31.62 82.19,52.35 JP2.1
DRDY
  Bottom 0.203: U3.29 87.16,20.64 89.27,18.53 93.53,18.53 95.57,20.57 95.57,26.78 89.71,32.64 89.71,45.89 96.28,52.46 JP2.11
GND  (via drill 0.35, 3.2 pad 6.35)
  other vias: 3.17,3.17 126.83,3.17 81.44,32.1 17.93,52.44 32.82,50.15 46.84,50.15 62.25,44.79 76.94,50.35 80.06,50.35 107.9,50.06 45.37,47.07 86.52,14.94 90.87,27.23 96.68,36.1 106.78,27.55 90.73,45.47 50.35,36.14 19.82,35.99 35.05,36.22 65.51,36.31 78.23,36.91 97.15,17.09 90.97,10.99
  pour Top (isolate 0.254): 0,60 0,0 130,0 130,60
  pour Bottom (isolate 0.254): 0,60 0,0 130,0 130,60
N$1
  Top 0.406: IC1.4 11.97,16.08 R1.1
  Top 0.813: J1.1 9.13,7.37 C1.1 R1.1
N$2
  Top 0.406: IC1.1 16.43,17.55 16.2,17.32 13.55,17.32 12.58,18.29 R1.2
  Top 0.813: R3.1 9.45,18.6 C1.2 R1.2
N$3
  Top 0.508: IC3.3 13.89,23.68
  Top 0.61: 13.89,23.68 R2.2
  Top 0.813: R2.2 C2.1
N$4
  Top 0.813: R2.1 13.89,21.14 R3.2 C3.1
N$5
  Top 0.61: J2.1 23.73,7.77 R4.1 C4.1 26.57,16.13 IC2.4
N$6
  Top 0.406: IC2.1 31.03,17.86 30.52,17.35 28.08,17.35 27.07,18.36 26.3,18.36 C4.2
  Top 0.61: C4.2 R4.2 24.05,18.65 R6.1
N$7
  Top 0.406: IC4.3 28.49,23.73 R5.2
  Top 0.61: R5.2 C5.1
N$8
  Top 0.61: R5.1 28.49,21.19 R6.2 C6.1
N$9
  Top 0.61: J3.1 38.93,7.57 R7.1 C7.1 41.77,16.26 IC5.4
N$10
  Top 0.406: IC5.1 46.23,18.06 45.69,17.52 43.39,17.52 42.45,18.46 C7.2
  Top 0.61: C7.2 R7.2 39.25,18.78 R9.1
N$11
  Top 0.61: C8.1 R8.2 43.69,23.86 IC6.3
N$12
  Top 0.61: R8.1 41.47,21.64 R9.2 C9.1
N$13
  Top 0.61: J4.1 54.08,7.42 C10.1 56.32,16.55 | 56.32,16.55 R10.1 | IC7.4 56.62,16.25 56.32,16.55
N$14
  Top 0.406: IC7.1 61.38,17.87 61.01,17.5 58.57,17.5 57.62,18.45 R10.2
  Top 0.61: R10.2 C10.2 54.4,18.77 R12.1
N$15
  Top 0.61: C11.1 R11.2 58.84,23.85 IC8.3
N$16
  Top 0.61: R11.1 58.84,21.31 R12.2 C12.1
N$17
  Top 0.61: J5.1 68.73,7.77 R13.1 70.92,16.56 | 70.92,16.56 C13.1 | IC9.4 71.22,16.26 70.92,16.56
N$18
  Top 0.305: IC9.1 76.03,17.97 75.57,17.51 73.12,17.51 72.17,18.46 C13.2
  Top 0.61: C13.2 R13.2 69.05,18.78 R15.1
N$19
  Top 0.61: C14.1 R14.2 73.49,23.86 IC10.3
N$20
  Top 0.61: R14.1 73.49,21.32 R15.2 C15.1
N$21
  Top 0.508: R16.1 C16.1
  Top 0.61: C16.1 83.97,7.53 J6.1 | IC11.4 86.81,16.26 R16.1
N$22
  Top 0.305: IC11.1 91.27,18.06 90.71,17.5 88.39,17.5 87.43,18.46 86.71,18.46 R16.2
  Top 0.61: R18.1 84.29,18.78 C16.2 86.71,18.46
N$23
  Top 0.61: C17.1 R17.2 88.73,23.86 IC12.3
N$24
  Top 0.61: R17.1 86.51,21.64 | 86.51,21.64 R18.2 | C18.1 86.19,21.96 86.51,21.64
N$25
  Top 0.61: J7.1 99.21,7.29 R19.1 C19.1 102.05,16.26 IC13.4
N$26
  Top 0.305: IC13.1 106.51,18.05 105.98,17.52 103.55,17.52 102.61,18.46 C19.2
  Top 0.61: R21.1 99.53,18.78 R19.2 C19.2
N$27
  Top 0.61: C20.1 R20.2 103.97,23.86 IC14.3
N$28
  Top 0.61: R20.1 103.97,21.32 R21.2 C21.1
N$29
  Top 0.61: J8.1 114.45,7.05 R22.1 C22.1 117.29,16.26 IC15.4
N$30
  Top 0.305: IC15.1 121.75,17.99 121.28,17.52 118.87,17.52 117.89,18.5 117.03,18.5 C22.2
  Top 0.61: R24.1 114.77,18.78 114.61,18.62 | 114.61,18.62 R22.2 | C22.2 114.77,18.46 114.61,18.62
N$31
  Top 0.61: C23.1 R23.2 119.21,23.86 IC16.3
N$32
  Top 0.61: R23.1 116.99,21.64 R24.2 C24.1
N$33
  Top 0.406: C25.1 12.46,34.8 IC17.8 12.63,36.38 R25.2 14.68,33.84 R26.1
N$34
  Top 0.406: IC17.5 8.64,34.8 C25.2 R27.1
N$35
  Top 0.406: R28.2 9.28,46.22 C26.1 12.83,46.22 13.15,45.9 13.15,43.07 12.45,42.37 12.45,41.65 IC17.1 | IC17.1 | IC17.1 13.27,42.45 R30.1
N$36
  Top 0.406: C28.1 27.11,34.74 IC18.8 29.16,36.16 R31.2 29.01,36.01 R32.1
N$37
  Top 0.406: IC17.4 8.64,43.69 R29.2 9.28,44.32 C26.2
N$38
  Top 0.406: R33.1 C28.2 23.3,34.74 IC18.5
N$39
  Top 0.406: R34.2 25.78,46.49 C29.1 27.05,46.18 27.62,45.61 27.62,43.06 27.11,42.55 IC18.1 28.18,41.58 R36.1
N$40
  Top 0.406: IC18.4 23.3,43.63 R35.2 25.78,43.95 C29.2
N$41
  Top 0.508: C31.1 42.17,34.65 IC19.8 42.35,36.23 R37.2 44.4,33.69 R38.1
N$42
  Top 0.508: R39.1 C31.2 38.37,34.65 IC19.5
N$43
  Top 0.508: R40.2 C32.1 42.06,46.38 42.61,45.83 42.61,43.4 42.17,42.97 IC19.1 43.22,41.48 R42.1
N$44
  Top 0.508: IC19.4 38.37,43.53 R41.2 40.36,43.85 C32.2
N$45
  Top 0.508: C34.1 57.41,34.63 IC20.8 57.59,36.22 R43.2 59.64,33.68 R44.1
N$46
  Top 0.508: IC20.5 53.6,34.63 C34.2 R45.1
N$47
  Top 0.508: R48.1 58.54,41.47 IC20.1 57.41,42.77 57.91,43.26 57.91,45.74 57.31,46.34 C35.1 56.14,46.38 R46.2
N$48
  Top 0.508: IC20.4 53.6,43.52 R47.2 55.58,43.84 C35.2
N$49
  Top 0.61: C37.1 72.28,34.56 IC21.8 72.45,36.15 R49.2 74.5,33.79 R50.1
N$50
  Top 0.61: R51.1 C37.2 68.47,34.56 IC21.5
N$51
  Top 0.61: R52.2 C38.1 72.04,46.3 72.28,46.06 IC21.1 73.17,41.4 R54.1
N$52
  Top 0.61: IC21.4 68.47,43.45 R53.2 70.38,43.77 C38.2
N$53
  Top 0.61: C40.1 87.52,34.56 IC22.8 87.69,36.15 R55.2 89.74,33.61 R56.1
N$54
  Top 0.61: R57.1 C40.2 83.7,34.56 IC22.5
N$55
  Top 0.61: R58.2 86.18,46.31 | 86.18,46.31 C41.1 | R60.1 88.48,41.4 IC22.1 87.52,45.97 87.17,46.31 86.18,46.31
N$56
  Top 0.61: IC22.4 83.7,43.45 R59.2 85.58,43.77 C41.2
N$57
  Top 0.61: C43.1 102.75,34.56 IC23.8 102.93,36.15 R61.2 104.98,33.61 R62.1
N$58
  Top 0.61: R63.1 C43.2 98.94,34.56 IC23.5
N$59
  Top 0.61: R64.2 99.28,46.29 C44.1 101.48,46.32 102.26,46.32 102.75,45.83 IC23.1 103.61,41.4 R66.1
N$60
  Top 0.61: IC23.4 98.94,43.45 R65.2 100.83,43.77 C44.2
N$61
  Top 0.61: C46.1 118,34.56 IC24.8 118.17,36.15 R67.2 120.22,33.61 R68.1
N$62
  Top 0.61: R69.1 C46.2 114.19,34.56 IC24.5
N$63
  Top 0.61: R70.2 C47.1 | C47.1 | R72.1 120.21,41.4 IC24.1 118,45.88 117.57,46.31 C47.1
N$64
  Top 0.61: IC24.4 114.19,43.45 R71.2 116.12,43.77 C47.2
N$65
  Bottom 0.61: R73.1 IC25.8
N$66
  Bottom 0.61: IC25.6 R74.1
N$67
  Bottom 0.61: R74.2 61.52,27.23 C49.1 | C49.1 61.3,27.01 R75.1 | C49.1 C50.1
N$68
  Bottom 0.406: U2.3 61.02,21.11 61.42,21.5 61.42,23.1 61.04,23.48 59.76,23.48 59.39,23.85 R75.2
N$69
  Bottom 0.406: U2.6 56.74,21.11 57.05,20.8 C51.2 57.05,17.18 57.47,16.76 65.6,16.76 66,17.16 R77.1
N$70
  Bottom 0.406: U2.2 59.19,21.75 58.95,21.52 C51.1 R76.1
N$72
  Bottom 0.406: R78.1 57.76,12.66 58.34,13.23 U1.6 61.01,13.23 61.66,13.88 U1.2
N$121
  Bottom 0.254: U3.42 78.72,15.76 78.94,15.54 79.27,15.54 | 79.27,15.54 79.7,15.54 | 79.7,15.54 80.2,15.54 | 80.2,15.54 80.78,15.54 | 80.78,15.54 81.24,15.54 | 81.24,15.54 81.71,15.54 | 81.71,15.54 82,15.54 82.22,15.76 | 82.22,15.76 U3.35 | U3.36 81.72,15.55 81.71,15.54 | U3.37 81.22,15.56 81.24,15.54 | U3.38 80.72,15.6 80.78,15.54 | U3.39 80.22,15.56 80.2,15.54 | U3.40 79.72,15.56 79.7,15.54 | U3.41 79.22,15.59 79.27,15.54 | SJ1.2 84.81,13.17 82.22,15.76
S1  (via drill 1)
  Top 0.305: IC3.4 13.6,28.8 11.99,27.19 IC3.1
  Top 0.508: IC3.1 10.11,26.18 9.45,25.52 C3.2 | R25.1 16.68,36.28 v18.42,36.28
  Top 0.61: IC3.4 15.2,28.8 16.6,30.2 16.6,36.36 R25.1
S2  (via drill 1)
  Top 0.305: IC4.4 28.17,28.85 26.59,27.27 IC4.1
  Top 0.406: IC4.4 28.49,29.61 28.96,30.08 30.65,30.08 32.13,31.56 32.13,35.43 R31.1
  Top 0.508: 31.27,36.29 R31.1 33.46,36.33 v33.5,36.29
  Top 0.61: IC4.1 25.83,26.23 24.05,24.45 C6.2
S3  (via drill 1)
  Top 0.254: IC6.4 43.13,28.98 41.79,27.64 IC6.1
  Top 0.508: IC6.4 45.34,28.98 47.24,30.88 47.24,35.29 R37.1 48.48,36.23 v50.27,34.44
  Top 0.61: IC6.1 40.68,26.36 39.25,24.93 C9.2
S4  (via drill 1)
  Top 0.254: IC8.4 58.34,28.97 56.94,27.57 IC8.1
  Top 0.508: IC8.4 60.54,28.97 62.39,30.82 62.39,35.37 R43.1 63.62,36.22 v63.65,36.19
  Top 0.61: IC8.1 55.73,26.35 54.36,24.98 54.36,23.89 C12.2
S5  (via drill 1)
  Top 0.305: IC10.4 73.04,28.98 71.58,27.52 71.58,26.37 IC10.1
  Top 0.508: 76.69,35.86 R49.1 78.41,34.14 v78.41,32.68
  Top 0.61: IC10.1 70.46,26.36 69.05,24.95 C15.2 | IC10.4 75.54,28.98 76.4,29.84 R49.1
S6  (via drill 1)
  Top 0.305: IC12.4 88.2,28.98 86.83,27.61 IC12.1
  Top 0.508: R55.1 91.83,35.96 v94.47,35.96
  Top 0.61: IC12.1 85.8,26.36 84.29,24.85 C18.2 | IC12.4 91.62,28.98 92.8,30.16 92.8,34.99 R55.1
S7  (via drill 1)
  Top 0.305: IC14.4 103.42,28.98 102.07,27.63 IC14.1
  Top 0.508: R61.1 109.09,36.15 v109.15,36.09
  Top 0.61: IC14.1 100.91,26.36 99.53,24.98 C21.2 | IC14.4 105.62,28.98 107.67,31.03 107.67,35.36 R61.1
S8  (via drill 1)
  Top 0.305: IC16.4 118.69,28.98 117.31,27.6 IC16.1
  Top 0.508: R67.1 124.71,36.15 v124.76,36.2
  Top 0.61: IC16.1 116.2,26.36 114.73,24.89 114.73,23.9 C24.2 | IC16.4 121,28.98 123.22,31.2 123.22,35.05 R67.1
SCLK
  Bottom 0.203: U3.28 87.34,21.14 89.31,19.17 93.35,19.17 94.8,20.62 94.8,26.74 88.98,32.56 88.98,47.04 95.02,53.08 95.02,55.02 JP2.12
SYNC
  Bottom 0.203: U3.11 80.72,32.41 81.6,33.29 81.6,54.94 82.93,56.27 JP2.2
VCOM  (via drill 0.35)
  Top 0.406: IC17.2 11.18,41.62 11.18,40.34 11.85,39.66 14.32,39.66 C27.1
  Top 0.508: IC19.2 40.91,40.41 41.42,39.9 44.73,39.9 C33.1 | IC20.2 56.15,40.53 56.91,39.77 59.55,39.77 59.77,39.77 C36.1
  Top 0.61: IC22.2 86.25,40.28 | 86.25,40.28 87.45,39.08 88.88,39.08 C42.1 89.96,39.04 90.27,38.73 100.06,38.73 101.48,40.16 | IC21.2 71,40.37 | 71,40.37 72.18,39.19 73.83,39.19 C39.1 75.04,39.23 75.46,38.81 84.66,38.81 86.13,40.28 86.25,40.28 | IC24.2 116.72,40.12 117.05,39.8 | 117.05,39.8 117.83,39.02 120.2,39.02 C48.1 | IC23.2 101.48,40.16 | 101.48,40.16 102.06,39.58 104.32,39.58 C45.1 105.07,39.32 105.7,38.69 115.93,38.69 117.05,39.8 | 71,40.37 71,39.56 70.16,38.72 60.6,38.72 59.55,39.77 | 56.91,39.77 56.01,38.87 v48.44,38.87 45.62,38.87 45.07,39.42 C33.1 | 40.91,40.41 40.91,39.51 40.24,38.84 30.67,38.84 30.08,39.43 C30.1 29.82,40.27 26.11,40.27 | 26.11,40.27 24.65,38.82 15.25,38.82 14.93,39.14 C27.1 | IC18.2 25.84,40.55 26.11,40.27
  Bottom 0.203: R78.2 50.12,14.56 48.44,16.24 v48.44,38.87
VCOMM
  Bottom 0.254: U3.55 68.42,22.14 67.49,21.21 67.49,15.14 66.92,14.57 C54.1
  Bottom 0.406: U1.3 64.44,13.23 65.77,14.57 C54.1
VREFP
  Bottom 0.254: U3.56 C53.1
  Bottom 0.406: C52.1 63.52,22.6 R76.2 R77.2 66,22.63 C53.1

### Text on the board
tPlace: Charge Amplifier Board / Grupo IPC / Wim-Systems / www.ipc.com.mx / www.wim-systems.com | S1 | S2 | S4 | S5 | S6 | S7 | S8 | S3 | Sensor 1 | Sensor 2 | Sensor 3 | Sensor 4 | Sensor 5 | Sensor 6 | Sensor 7 | Sensor 8 | M3 | C:/Users/Mecatronica/Documents/eagle/projects/DATALOGGER_IPC_RPI_FPGA/ipc blanco.bmp